# Altium project US29080671(A).PrjPCB (part 3 of 10)

## Sheet A7_FUNCTION2 - Ⅱ.SchDoc
size A3
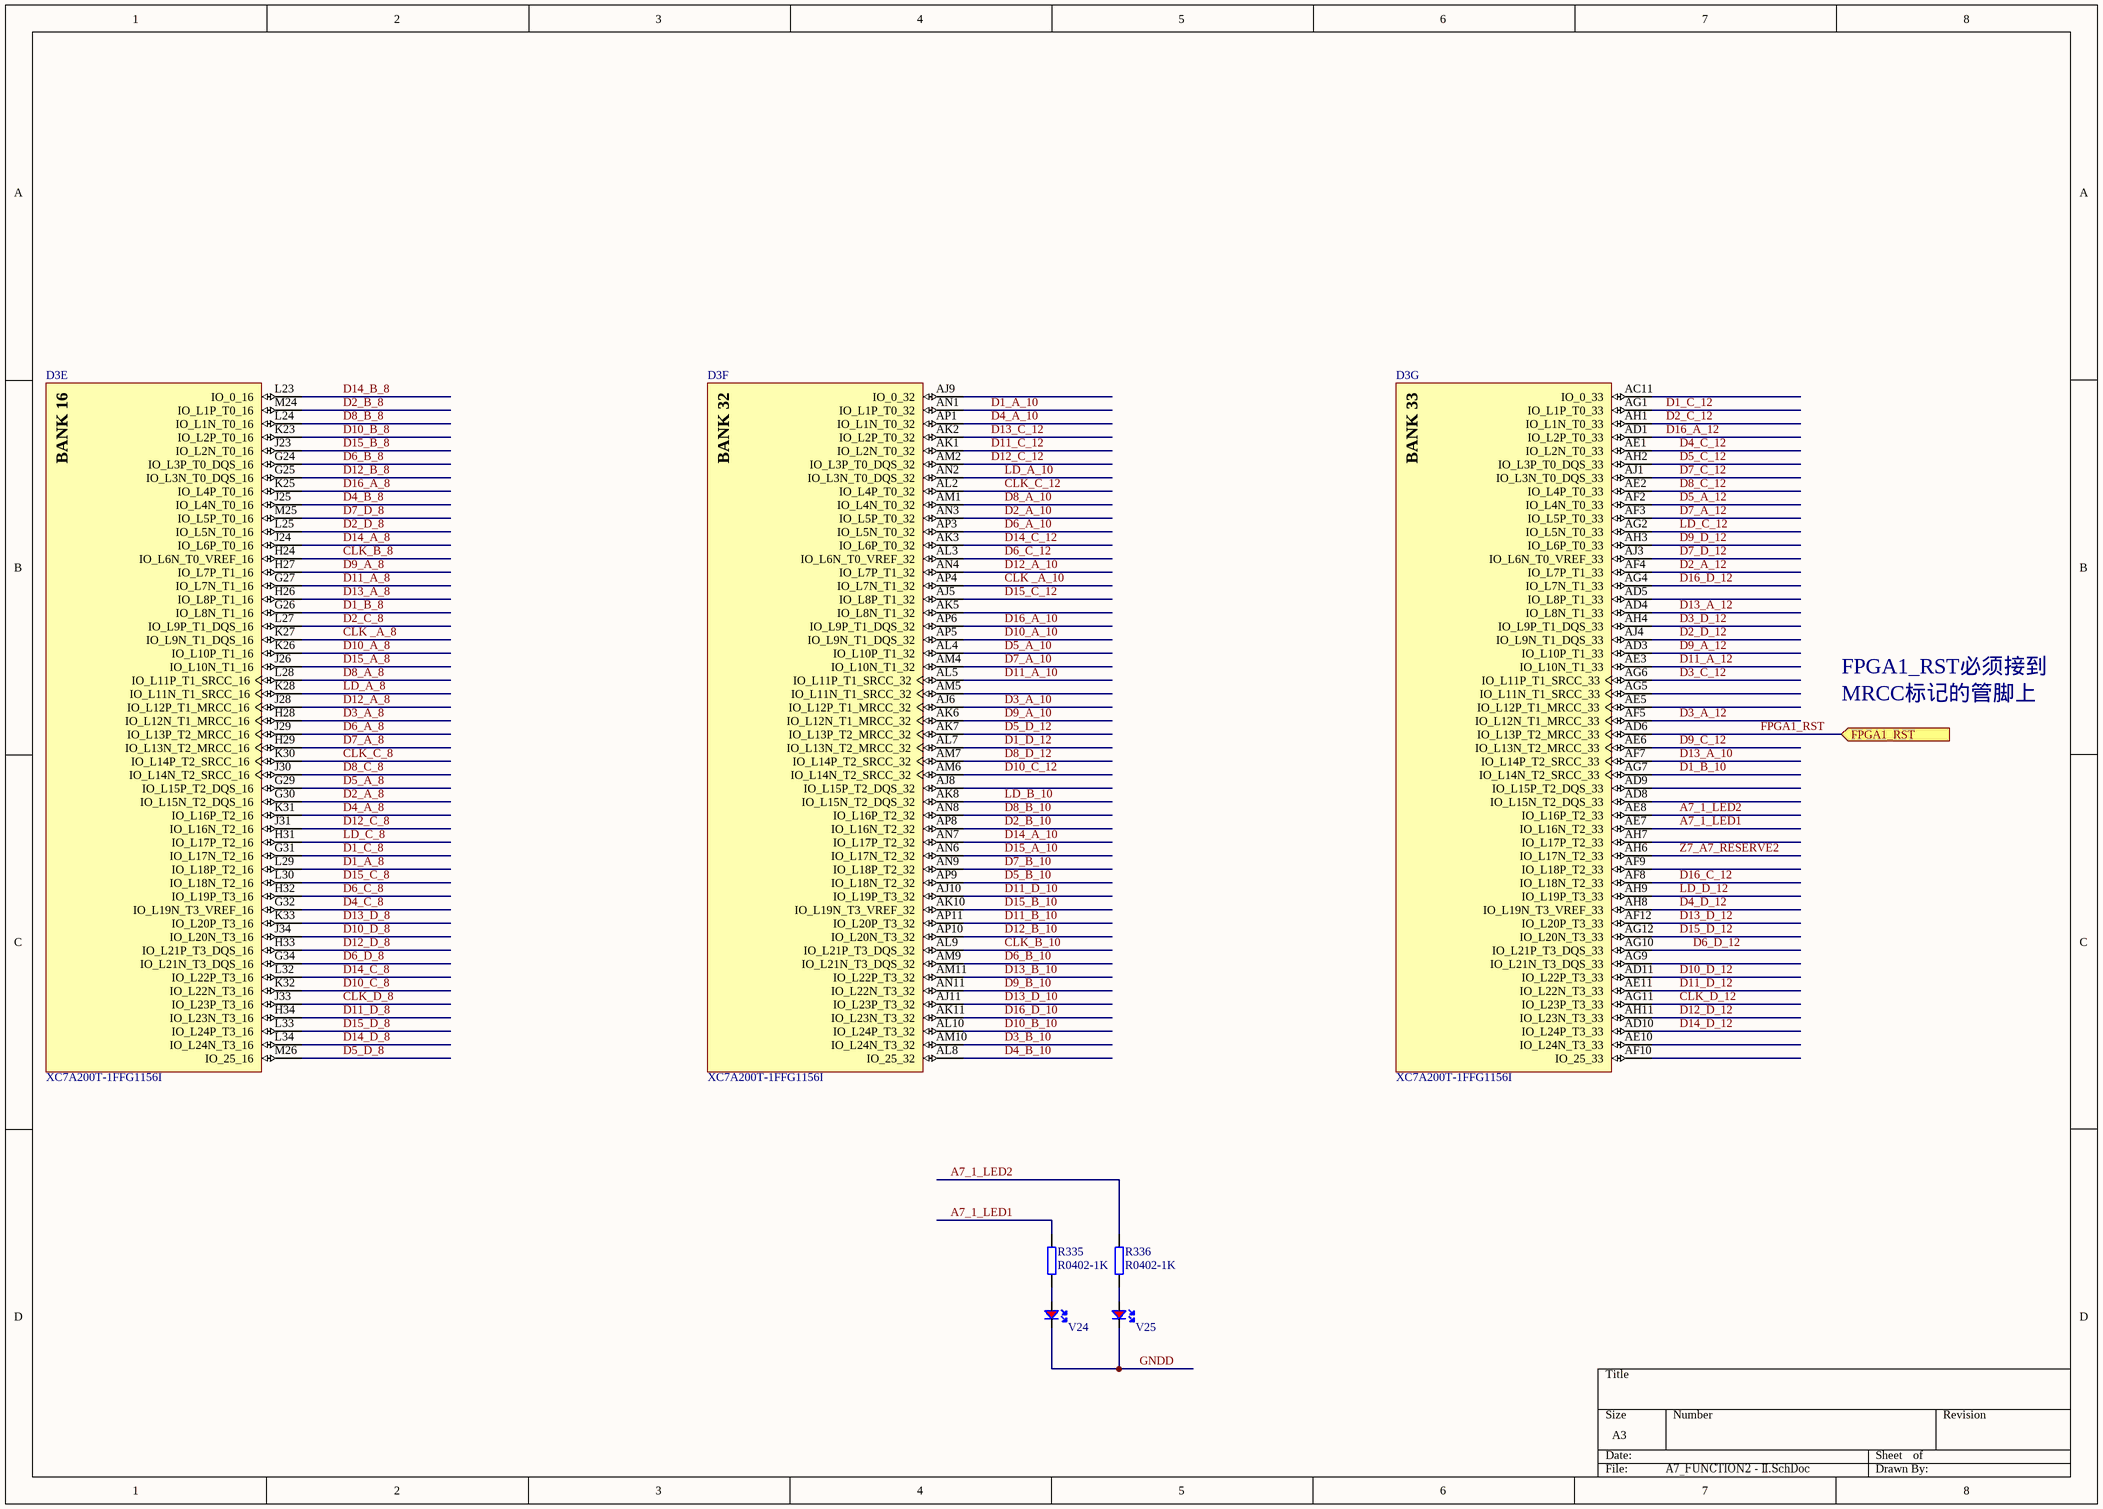
[diagram p11: A7_FUNCTION2 - Ⅱ.SchDoc]

### Parts
D3  XC7A200T-1FFG1156I  [FFG1156]  (parts E,F,G of 18)
R335  R0402-1K  [R0402]
R336  R0402-1K  [R0402]
V24  LED-R0603  [LED-R0603]  (value not drawn)
V25  LED-R0603  [LED-R0603]  (value not drawn)

### Ports
FPGA1_RST (in)

### Nets
GNDD: V24.2(K) V25.2(K)
A7_1_LED1: D3.AE7(IO_L16N_T2_33) R335.2
A7_1_LED2: D3.AE8(IO_L16P_T2_33) R336.2
CLK _A_8: D3.K27(IO_L9N_T1_DQS_16)
CLK _A_10: D3.AP4(IO_L7N_T1_32)
CLK_B_8: D3.H24(IO_L6N_T0_VREF_16)
CLK_B_10: D3.AL9(IO_L21P_T3_DQS_32)
CLK_C_8: D3.K30(IO_L14P_T2_SRCC_16)
CLK_C_12: D3.AL2(IO_L4P_T0_32)
CLK_D_8: D3.J33(IO_L23P_T3_16)
CLK_D_12: D3.AG11(IO_L23P_T3_33)
D1_A_8: D3.L29(IO_L18P_T2_16)
D1_A_10: D3.AN1(IO_L1P_T0_32)
D1_B_8: D3.G26(IO_L8N_T1_16)
D1_B_10: D3.AG7(IO_L14N_T2_SRCC_33)
D1_C_8: D3.G31(IO_L17N_T2_16)
D1_C_12: D3.AG1(IO_L1P_T0_33)
D1_D_12: D3.AL7(IO_L13N_T2_MRCC_32)
D2_A_8: D3.G30(IO_L15N_T2_DQS_16)
D2_A_10: D3.AN3(IO_L5P_T0_32)
D2_A_12: D3.AF4(IO_L7P_T1_33)
D2_B_8: D3.M24(IO_L1P_T0_16)
D2_B_10: D3.AP8(IO_L16N_T2_32)
D2_C_8: D3.L27(IO_L9P_T1_DQS_16)
D2_C_12: D3.AH1(IO_L1N_T0_33)
D2_D_8: D3.L25(IO_L5N_T0_16)
D2_D_12: D3.AJ4(IO_L9N_T1_DQS_33)
D3_A_8: D3.H28(IO_L12N_T1_MRCC_16)
D3_A_10: D3.AJ6(IO_L12P_T1_MRCC_32)
D3_A_12: D3.AF5(IO_L12N_T1_MRCC_33)
D3_B_10: D3.AM10(IO_L24N_T3_32)
D3_C_12: D3.AG6(IO_L11P_T1_SRCC_33)
D3_D_12: D3.AH4(IO_L9P_T1_DQS_33)
D4_A_8: D3.K31(IO_L16P_T2_16)
D4_A_10: D3.AP1(IO_L1N_T0_32)
D4_B_8: D3.J25(IO_L4N_T0_16)
D4_B_10: D3.AL8(IO_25_32)
D4_C_8: D3.G32(IO_L19N_T3_VREF_16)
D4_C_12: D3.AE1(IO_L2N_T0_33)
D4_D_12: D3.AH8(IO_L19N_T3_VREF_33)
D5_A_8: D3.G29(IO_L15P_T2_DQS_16)
D5_A_10: D3.AL4(IO_L10P_T1_32)
D5_A_12: D3.AF2(IO_L4N_T0_33)
D5_B_10: D3.AP9(IO_L18N_T2_32)
D5_C_12: D3.AH2(IO_L3P_T0_DQS_33)
D5_D_8: D3.M26(IO_25_16)
D5_D_12: D3.AK7(IO_L13P_T2_MRCC_32)
D6_A_8: D3.J29(IO_L13P_T2_MRCC_16)
D6_A_10: D3.AP3(IO_L5N_T0_32)
D6_B_8: D3.G24(IO_L3P_T0_DQS_16)
D6_B_10: D3.AM9(IO_L21N_T3_DQS_32)
D6_C_8: D3.H32(IO_L19P_T3_16)
D6_C_12: D3.AL3(IO_L6N_T0_VREF_32)
D6_D_8: D3.G34(IO_L21N_T3_DQS_16)
D6_D_12: D3.AG10(IO_L21P_T3_DQS_33)
D7_A_8: D3.H29(IO_L13N_T2_MRCC_16)
D7_A_10: D3.AM4(IO_L10N_T1_32)
D7_A_12: D3.AF3(IO_L5P_T0_33)
D7_B_10: D3.AN9(IO_L18P_T2_32)
D7_C_12: D3.AJ1(IO_L3N_T0_DQS_33)
D7_D_8: D3.M25(IO_L5P_T0_16)
D7_D_12: D3.AJ3(IO_L6N_T0_VREF_33)
D8_A_8: D3.L28(IO_L11P_T1_SRCC_16)
D8_A_10: D3.AM1(IO_L4N_T0_32)
D8_B_8: D3.L24(IO_L1N_T0_16)
D8_B_10: D3.AN8(IO_L16P_T2_32)
D8_C_8: D3.J30(IO_L14N_T2_SRCC_16)
D8_C_12: D3.AE2(IO_L4P_T0_33)
D8_D_12: D3.AM7(IO_L14P_T2_SRCC_32)
D9_A_8: D3.H27(IO_L7P_T1_16)
D9_A_10: D3.AK6(IO_L12N_T1_MRCC_32)
D9_A_12: D3.AD3(IO_L10P_T1_33)
D9_B_10: D3.AN11(IO_L22N_T3_32)
D9_C_12: D3.AE6(IO_L13N_T2_MRCC_33)
D9_D_12: D3.AH3(IO_L6P_T0_33)
D10_A_8: D3.K26(IO_L10P_T1_16)
D10_A_10: D3.AP5(IO_L9N_T1_DQS_32)
D10_B_8: D3.K23(IO_L2P_T0_16)
D10_B_10: D3.AL10(IO_L24P_T3_32)
D10_C_8: D3.K32(IO_L22N_T3_16)
D10_C_12: D3.AM6(IO_L14N_T2_SRCC_32)
D10_D_8: D3.J34(IO_L20N_T3_16)
D10_D_12: D3.AD11(IO_L22P_T3_33)
D11_A_8: D3.G27(IO_L7N_T1_16)
D11_A_10: D3.AL5(IO_L11P_T1_SRCC_32)
D11_A_12: D3.AE3(IO_L10N_T1_33)
D11_B_10: D3.AP11(IO_L20P_T3_32)
D11_C_12: D3.AK1(IO_L2N_T0_32)
D11_D_8: D3.H34(IO_L23N_T3_16)
D11_D_10: D3.AJ10(IO_L19P_T3_32)
D11_D_12: D3.AE11(IO_L22N_T3_33)
D12_A_8: D3.J28(IO_L12P_T1_MRCC_16)
D12_A_10: D3.AN4(IO_L7P_T1_32)
D12_B_8: D3.G25(IO_L3N_T0_DQS_16)
D12_B_10: D3.AP10(IO_L20N_T3_32)
D12_C_8: D3.J31(IO_L16N_T2_16)
D12_C_12: D3.AM2(IO_L3P_T0_DQS_32)
D12_D_8: D3.H33(IO_L21P_T3_DQS_16)
D12_D_12: D3.AH11(IO_L23N_T3_33)
D13_A_8: D3.H26(IO_L8P_T1_16)
D13_A_10: D3.AF7(IO_L14P_T2_SRCC_33)
D13_A_12: D3.AD4(IO_L8N_T1_33)
D13_B_10: D3.AM11(IO_L22P_T3_32)
D13_C_12: D3.AK2(IO_L2P_T0_32)
D13_D_8: D3.K33(IO_L20P_T3_16)
D13_D_10: D3.AJ11(IO_L23P_T3_32)
D13_D_12: D3.AF12(IO_L20P_T3_33)
D14_A_8: D3.J24(IO_L6P_T0_16)
D14_A_10: D3.AN7(IO_L17P_T2_32)
D14_B_8: D3.L23(IO_0_16)
D14_C_8: D3.L32(IO_L22P_T3_16)
D14_C_12: D3.AK3(IO_L6P_T0_32)
D14_D_8: D3.L34(IO_L24N_T3_16)
D14_D_12: D3.AD10(IO_L24P_T3_33)
D15_A_8: D3.J26(IO_L10N_T1_16)
D15_A_10: D3.AN6(IO_L17N_T2_32)
D15_B_8: D3.J23(IO_L2N_T0_16)
D15_B_10: D3.AK10(IO_L19N_T3_VREF_32)
D15_C_8: D3.L30(IO_L18N_T2_16)
D15_C_12: D3.AJ5(IO_L8P_T1_32)
D15_D_8: D3.L33(IO_L24P_T3_16)
D15_D_12: D3.AG12(IO_L20N_T3_33)
D16_A_8: D3.K25(IO_L4P_T0_16)
D16_A_10: D3.AP6(IO_L9P_T1_DQS_32)
D16_A_12: D3.AD1(IO_L2P_T0_33)
D16_C_12: D3.AF8(IO_L18N_T2_33)
D16_D_10: D3.AK11(IO_L23N_T3_32)
D16_D_12: D3.AG4(IO_L7N_T1_33)
FPGA1_RST: D3.AD6(IO_L13P_T2_MRCC_33) ; port FPGA1_RST
LD_A_8: D3.K28(IO_L11N_T1_SRCC_16)
LD_A_10: D3.AN2(IO_L3N_T0_DQS_32)
LD_B_10: D3.AK8(IO_L15N_T2_DQS_32)
LD_C_8: D3.H31(IO_L17P_T2_16)
LD_C_12: D3.AG2(IO_L5N_T0_33)
LD_D_12: D3.AH9(IO_L19P_T3_33)
Z7_A7_RESERVE2: D3.AH6(IO_L17N_T2_33)
NetR335_1: R335.1 V24.1(A)
NetR336_1: R336.1 V25.1(A)

Not connected (* = marked no-connect by the designer): D3 AC11(IO_0_33) AD5(IO_L8P_T1_33) AD8(IO_L15N_T2_DQS_33) AD9(IO_L15P_T2_DQS_33) AE5(IO_L12P_T1_MRCC_33) AE10(IO_L24N_T3_33) AF9(IO_L18P_T2_33) AF10(IO_25_33) AG5(IO_L11N_T1_SRCC_33) AG9(IO_L21N_T3_DQS_33) AH7(IO_L17P_T2_33) AJ8(IO_L15P_T2_DQS_32) AJ9(IO_0_32) AK5(IO_L8N_T1_32) AM5(IO_L11N_T1_SRCC_32)

### Notes on the sheet
- FPGA1_RST必须接到
- MRCC标记的管脚上
- (in symbol XC7A200T-1FFG1156I, part E) BANK 16
- (in symbol XC7A200T-1FFG1156I, part F) BANK 32
- (in symbol XC7A200T-1FFG1156I, part G) BANK 33

### Library data of the parts
D3 = XC7A200T-1FFG1156I: Artix-7 FPGA, 500 User I/Os, 16 GTP, 1156-Ball BGA, Speed Grade 1, Industrial Grade, Pb-Free; Manufacturer: Xilinx; Block RAM Blocks (18Kb): 730; Block RAM Blocks (36Kb): 365; Block RAM Blocks (Max Kb): 13140; CLBs (Slices): 33650; Clock Mgmt Tiles (CMTs): 10; DSP48E1 Slices: 740; Logic Cells: 215360; Max User I/O: 500; Speed Grade: -1; DatasheetVersion: v1.12; PackageVersion: Rev 1.8; PackageReference: FFG1156; PackageDescription: Flip-Chip BGA, Body 35 x 35 mm, 1.0 mm Pitch; CLBs (Max Distributed RAM Kb): 2888; Generic Part Number: XC7A200T; RoHS: Pb-Free; Mounting Technology: Surface Mount; Code_JEDEC: MS-034-AAR-1; PartNumber: XC7A200T-1FFG1156I; ComponentLink1Description: Datasheet; ComponentLink1URL: http://www.xilinx.com/support/documentation/data_sheets/ds180_7Series_Overview.pdf; ComponentLink2Description: Package Specification; ComponentLink2URL: http://www.xilinx.com/support/documentation/user_guides/ug475_7Series_Pkg_Pinout.pdf; ComponentLink3Description: DC and Switching Characteristics; ComponentLink3URL: http://www.xilinx.com/support/documentation/data_sheets/ds181_Artix_7_Data_Sheet.pdf; ComponentLink4Description: Package File; ComponentLink4URL: http://www.xilinx.com/support/packagefiles/a7packages/xc7a200tfbg676pkg.txt; ComponentLink5Description: Packaging and Pinout; ComponentLink5URL: http://www.xilinx.com/support/documentation/user_guides/ug475_7Series_Pkg_Pinout.pdf
R335 R336 = R0402-10K: Manufacturer: SAMSUNG; Part_number: R0402-1K; Part_type: RES; Value: R0402-1K; Schematic_Part: RES; PCB_Footprint: R0402
V24 V25 = LED-R0603: 表贴发光二极管, 0603封装, 体积1.6x0.8mm, 红色, 高度0.8mm; Part_type: DIODES; Part_number: LED-R0603; Value: LED-R0603; Schematic_Part: LED-R; PCB_Footprint: LED-R0603

## Sheet A7_FUNCTION3 - Ⅱ.SchDoc
size A3
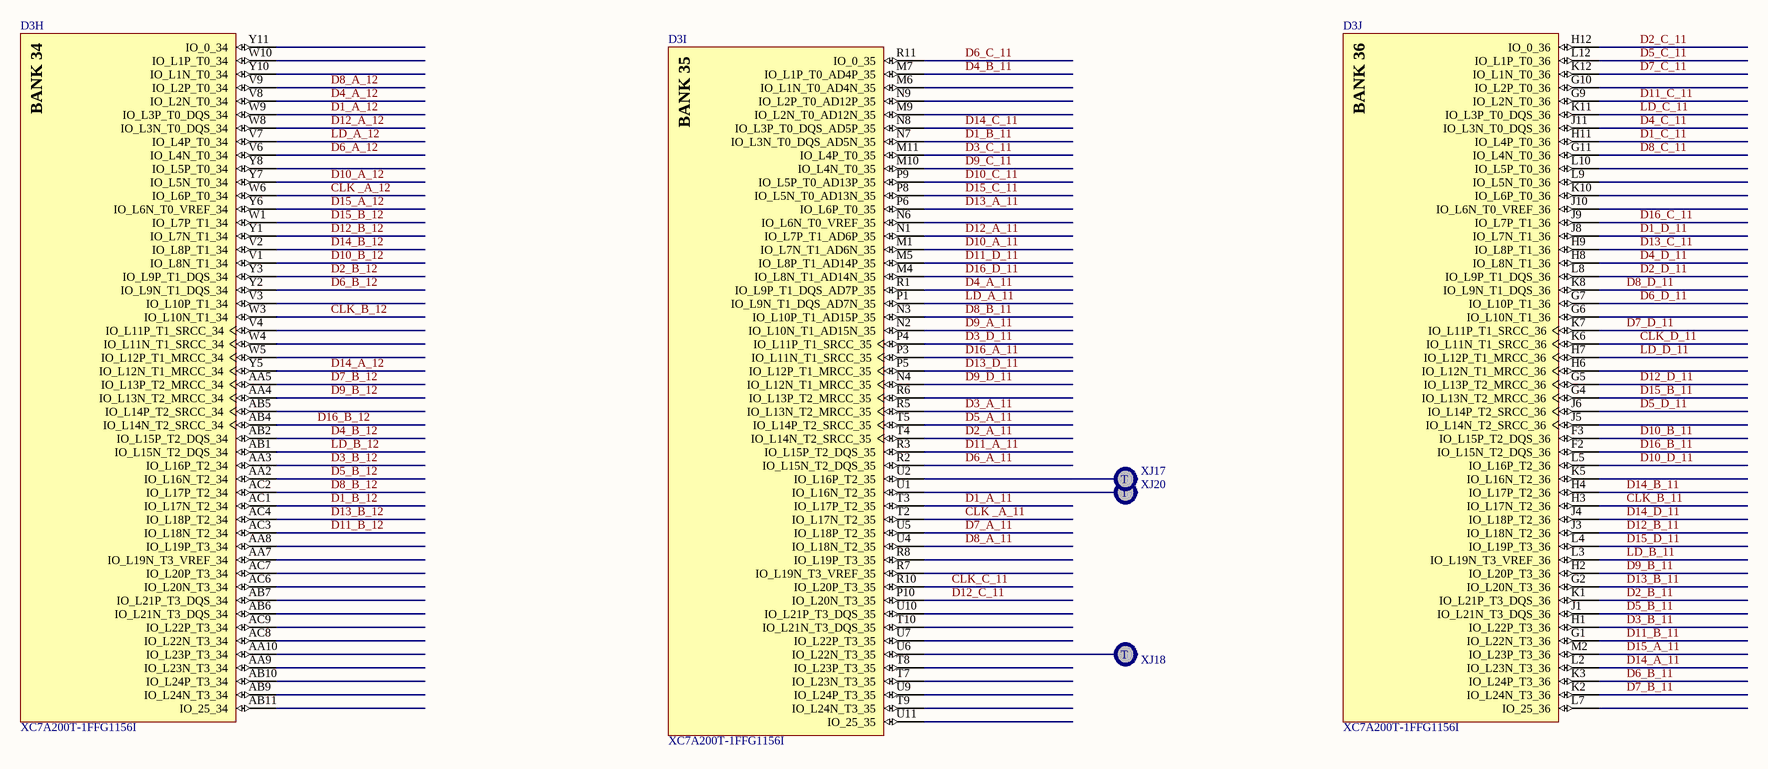
[diagram p12: A7_FUNCTION3 - Ⅱ.SchDoc]

### Parts
D3  XC7A200T-1FFG1156I  [FFG1156]  (parts H,I,J of 18)
XJ17  TESTPOINT  [TEST-pin]  (value not drawn)
XJ18  TESTPOINT  [TEST-pin]  (value not drawn)
XJ20  TESTPOINT  [TEST-pin]  (value not drawn)

### Nets
CLK _A_11: D3.T2(IO_L17N_T2_35)
CLK _A_12: D3.W6(IO_L6P_T0_34)
CLK_B_11: D3.H3(IO_L17N_T2_36)
CLK_B_12: D3.W3(IO_L10N_T1_34)
CLK_C_11: D3.R10(IO_L20P_T3_35)
CLK_D_11: D3.K6(IO_L11N_T1_SRCC_36)
D1_A_11: D3.T3(IO_L17P_T2_35)
D1_A_12: D3.W9(IO_L3P_T0_DQS_34)
D1_B_11: D3.N7(IO_L3N_T0_DQS_AD5N_35)
D1_B_12: D3.AC1(IO_L17N_T2_34)
D1_C_11: D3.H11(IO_L4P_T0_36)
D1_D_11: D3.J8(IO_L7N_T1_36)
D2_A_11: D3.T4(IO_L14N_T2_SRCC_35)
D2_B_11: D3.K1(IO_L21P_T3_DQS_36)
D2_B_12: D3.Y3(IO_L9P_T1_DQS_34)
D2_C_11: D3.H12(IO_0_36)
D2_D_11: D3.L8(IO_L9P_T1_DQS_36)
D3_A_11: D3.R5(IO_L13N_T2_MRCC_35)
D3_B_11: D3.H1(IO_L22P_T3_36)
D3_B_12: D3.AA3(IO_L16P_T2_34)
D3_C_11: D3.M11(IO_L4P_T0_35)
D3_D_11: D3.P4(IO_L11P_T1_SRCC_35)
D4_A_11: D3.R1(IO_L9P_T1_DQS_AD7P_35)
D4_A_12: D3.V8(IO_L2N_T0_34)
D4_B_11: D3.M7(IO_L1P_T0_AD4P_35)
D4_B_12: D3.AB2(IO_L15P_T2_DQS_34)
D4_C_11: D3.J11(IO_L3N_T0_DQS_36)
D4_D_11: D3.H8(IO_L8N_T1_36)
D5_A_11: D3.T5(IO_L14P_T2_SRCC_35)
D5_B_11: D3.J1(IO_L21N_T3_DQS_36)
D5_B_12: D3.AA2(IO_L16N_T2_34)
D5_C_11: D3.L12(IO_L1P_T0_36)
D5_D_11: D3.J6(IO_L14P_T2_SRCC_36)
D6_A_11: D3.R2(IO_L15N_T2_DQS_35)
D6_A_12: D3.V6(IO_L4N_T0_34)
D6_B_11: D3.K3(IO_L24P_T3_36)
D6_B_12: D3.Y2(IO_L9N_T1_DQS_34)
D6_C_11: D3.R11(IO_0_35)
D6_D_11: D3.G7(IO_L10P_T1_36)
D7_A_11: D3.U5(IO_L18P_T2_35)
D7_B_11: D3.K2(IO_L24N_T3_36)
D7_B_12: D3.AA5(IO_L13P_T2_MRCC_34)
D7_C_11: D3.K12(IO_L1N_T0_36)
D7_D_11: D3.K7(IO_L11P_T1_SRCC_36)
D8_A_11: D3.U4(IO_L18N_T2_35)
D8_A_12: D3.V9(IO_L2P_T0_34)
D8_B_11: D3.N3(IO_L10P_T1_AD15P_35)
D8_B_12: D3.AC2(IO_L17P_T2_34)
D8_C_11: D3.G11(IO_L4N_T0_36)
D8_D_11: D3.K8(IO_L9N_T1_DQS_36)
D9_A_11: D3.N2(IO_L10N_T1_AD15N_35)
D9_B_11: D3.H2(IO_L20P_T3_36)
D9_B_12: D3.AA4(IO_L13N_T2_MRCC_34)
D9_C_11: D3.M10(IO_L4N_T0_35)
D9_D_11: D3.N4(IO_L12N_T1_MRCC_35)
D10_A_11: D3.M1(IO_L7N_T1_AD6N_35)
D10_A_12: D3.Y7(IO_L5N_T0_34)
D10_B_11: D3.F3(IO_L15P_T2_DQS_36)
D10_B_12: D3.V1(IO_L8N_T1_34)
D10_C_11: D3.P9(IO_L5P_T0_AD13P_35)
D10_D_11: D3.L5(IO_L16P_T2_36)
D11_A_11: D3.R3(IO_L15P_T2_DQS_35)
D11_B_11: D3.G1(IO_L22N_T3_36)
D11_B_12: D3.AC3(IO_L18N_T2_34)
D11_C_11: D3.G9(IO_L2N_T0_36)
D11_D_11: D3.M5(IO_L8P_T1_AD14P_35)
D12_A_11: D3.N1(IO_L7P_T1_AD6P_35)
D12_A_12: D3.W8(IO_L3N_T0_DQS_34)
D12_B_11: D3.J3(IO_L18N_T2_36)
D12_B_12: D3.Y1(IO_L7N_T1_34)
D12_C_11: D3.P10(IO_L20N_T3_35)
D12_D_11: D3.G5(IO_L13P_T2_MRCC_36)
D13_A_11: D3.P6(IO_L6P_T0_35)
D13_B_11: D3.G2(IO_L20N_T3_36)
D13_B_12: D3.AC4(IO_L18P_T2_34)
D13_C_11: D3.H9(IO_L8P_T1_36)
D13_D_11: D3.P5(IO_L12P_T1_MRCC_35)
D14_A_11: D3.L2(IO_L23N_T3_36)
D14_A_12: D3.Y5(IO_L12N_T1_MRCC_34)
D14_B_11: D3.H4(IO_L17P_T2_36)
D14_B_12: D3.V2(IO_L8P_T1_34)
D14_C_11: D3.N8(IO_L3P_T0_DQS_AD5P_35)
D14_D_11: D3.J4(IO_L18P_T2_36)
D15_A_11: D3.M2(IO_L23P_T3_36)
D15_A_12: D3.Y6(IO_L6N_T0_VREF_34)
D15_B_11: D3.G4(IO_L13N_T2_MRCC_36)
D15_B_12: D3.W1(IO_L7P_T1_34)
D15_C_11: D3.P8(IO_L5N_T0_AD13N_35)
D15_D_11: D3.L4(IO_L19P_T3_36)
D16_A_11: D3.P3(IO_L11N_T1_SRCC_35)
D16_B_11: D3.F2(IO_L15N_T2_DQS_36)
D16_B_12: D3.AB4(IO_L14N_T2_SRCC_34)
D16_C_11: D3.J9(IO_L7P_T1_36)
D16_D_11: D3.M4(IO_L8N_T1_AD14N_35)
LD_A_11: D3.P1(IO_L9N_T1_DQS_AD7N_35)
LD_A_12: D3.V7(IO_L4P_T0_34)
LD_B_11: D3.L3(IO_L19N_T3_VREF_36)
LD_B_12: D3.AB1(IO_L15N_T2_DQS_34)
LD_C_11: D3.K11(IO_L3P_T0_DQS_36)
LD_D_11: D3.H7(IO_L12P_T1_MRCC_36)
NetD3_U1: D3.U1(IO_L16N_T2_35) XJ20.1(T)
NetD3_U2: D3.U2(IO_L16P_T2_35) XJ17.1(T)
NetD3_U6: D3.U6(IO_L22N_T3_35) XJ18.1(T)

Not connected (* = marked no-connect by the designer): D3 AA7(IO_L19N_T3_VREF_34) AA8(IO_L19P_T3_34) AA9(IO_L23N_T3_34) AA10(IO_L23P_T3_34) AB5(IO_L14P_T2_SRCC_34) AB6(IO_L21N_T3_DQS_34) AB7(IO_L21P_T3_DQS_34) AB9(IO_L24N_T3_34) AB10(IO_L24P_T3_34) AB11(IO_25_34) AC6(IO_L20N_T3_34) AC7(IO_L20P_T3_34) AC8(IO_L22N_T3_34) AC9(IO_L22P_T3_34) G6(IO_L10N_T1_36) G10(IO_L2P_T0_36) H6(IO_L12N_T1_MRCC_36) J5(IO_L14N_T2_SRCC_36) J10(IO_L6N_T0_VREF_36) K5(IO_L16N_T2_36) K10(IO_L6P_T0_36) L7(IO_25_36) L9(IO_L5N_T0_36) L10(IO_L5P_T0_36) M6(IO_L1N_T0_AD4N_35) M9(IO_L2N_T0_AD12N_35) N6(IO_L6N_T0_VREF_35) N9(IO_L2P_T0_AD12P_35) R6(IO_L13P_T2_MRCC_35) R7(IO_L19N_T3_VREF_35) R8(IO_L19P_T3_35) T7(IO_L23N_T3_35) T8(IO_L23P_T3_35) T9(IO_L24N_T3_35) T10(IO_L21N_T3_DQS_35) U7(IO_L22P_T3_35) U9(IO_L24P_T3_35) U10(IO_L21P_T3_DQS_35) U11(IO_25_35) V3(IO_L10P_T1_34) V4(IO_L11P_T1_SRCC_34) W4(IO_L11N_T1_SRCC_34) W5(IO_L12P_T1_MRCC_34) W10(IO_L1P_T0_34) Y8(IO_L5P_T0_34) Y10(IO_L1N_T0_34) Y11(IO_0_34)

### Notes on the sheet
- (in symbol XC7A200T-1FFG1156I, part H) BANK 34
- (in symbol XC7A200T-1FFG1156I, part I) BANK 35
- (in symbol XC7A200T-1FFG1156I, part J) BANK 36

### Library data of the parts
D3 = XC7A200T-1FFG1156I: as D3 on sheet A7_FUNCTION2 - Ⅱ; DatasheetVersion: v1.12; PackageVersion: Rev 1.8; PackageReference: FFG1156; PackageDescription: Flip-Chip BGA, Body 35 x 35 mm, 1.0 mm Pitch; CLBs (Max Distributed RAM Kb): 2888; Generic Part Number: XC7A200T; RoHS: Pb-Free; Mounting Technology: Surface Mount; Code_JEDEC: MS-034-AAR-1; PartNumber: XC7A200T-1FFG1156I; ComponentLink1Description: Datasheet; ComponentLink1URL: http://www.xilinx.com/support/documentation/data_sheets/ds180_7Series_Overview.pdf; ComponentLink2Description: Package Specification; ComponentLink2URL: http://www.xilinx.com/support/documentation/user_guides/ug475_7Series_Pkg_Pinout.pdf; ComponentLink3Description: DC and Switching Characteristics; ComponentLink3URL: http://www.xilinx.com/support/documentation/data_sheets/ds181_Artix_7_Data_Sheet.pdf; ComponentLink4Description: Package File; ComponentLink4URL: http://www.xilinx.com/support/packagefiles/a7packages/xc7a200tfbg676pkg.txt; ComponentLink5Description: Packaging and Pinout; ComponentLink5URL: http://www.xilinx.com/support/documentation/user_guides/ug475_7Series_Pkg_Pinout.pdf
XJ17 XJ18 XJ20 = TESTPOINT: 测试点; Part_type: Miscellaneous; Part_number: TESTPOINT; Value: TESTPOINT; Schematic_Part: TESTPOINT; PCB_Footprint: TEST-pin

## Sheet A7_JTAG&CONFIG - Ⅱ.SchDoc
size A3
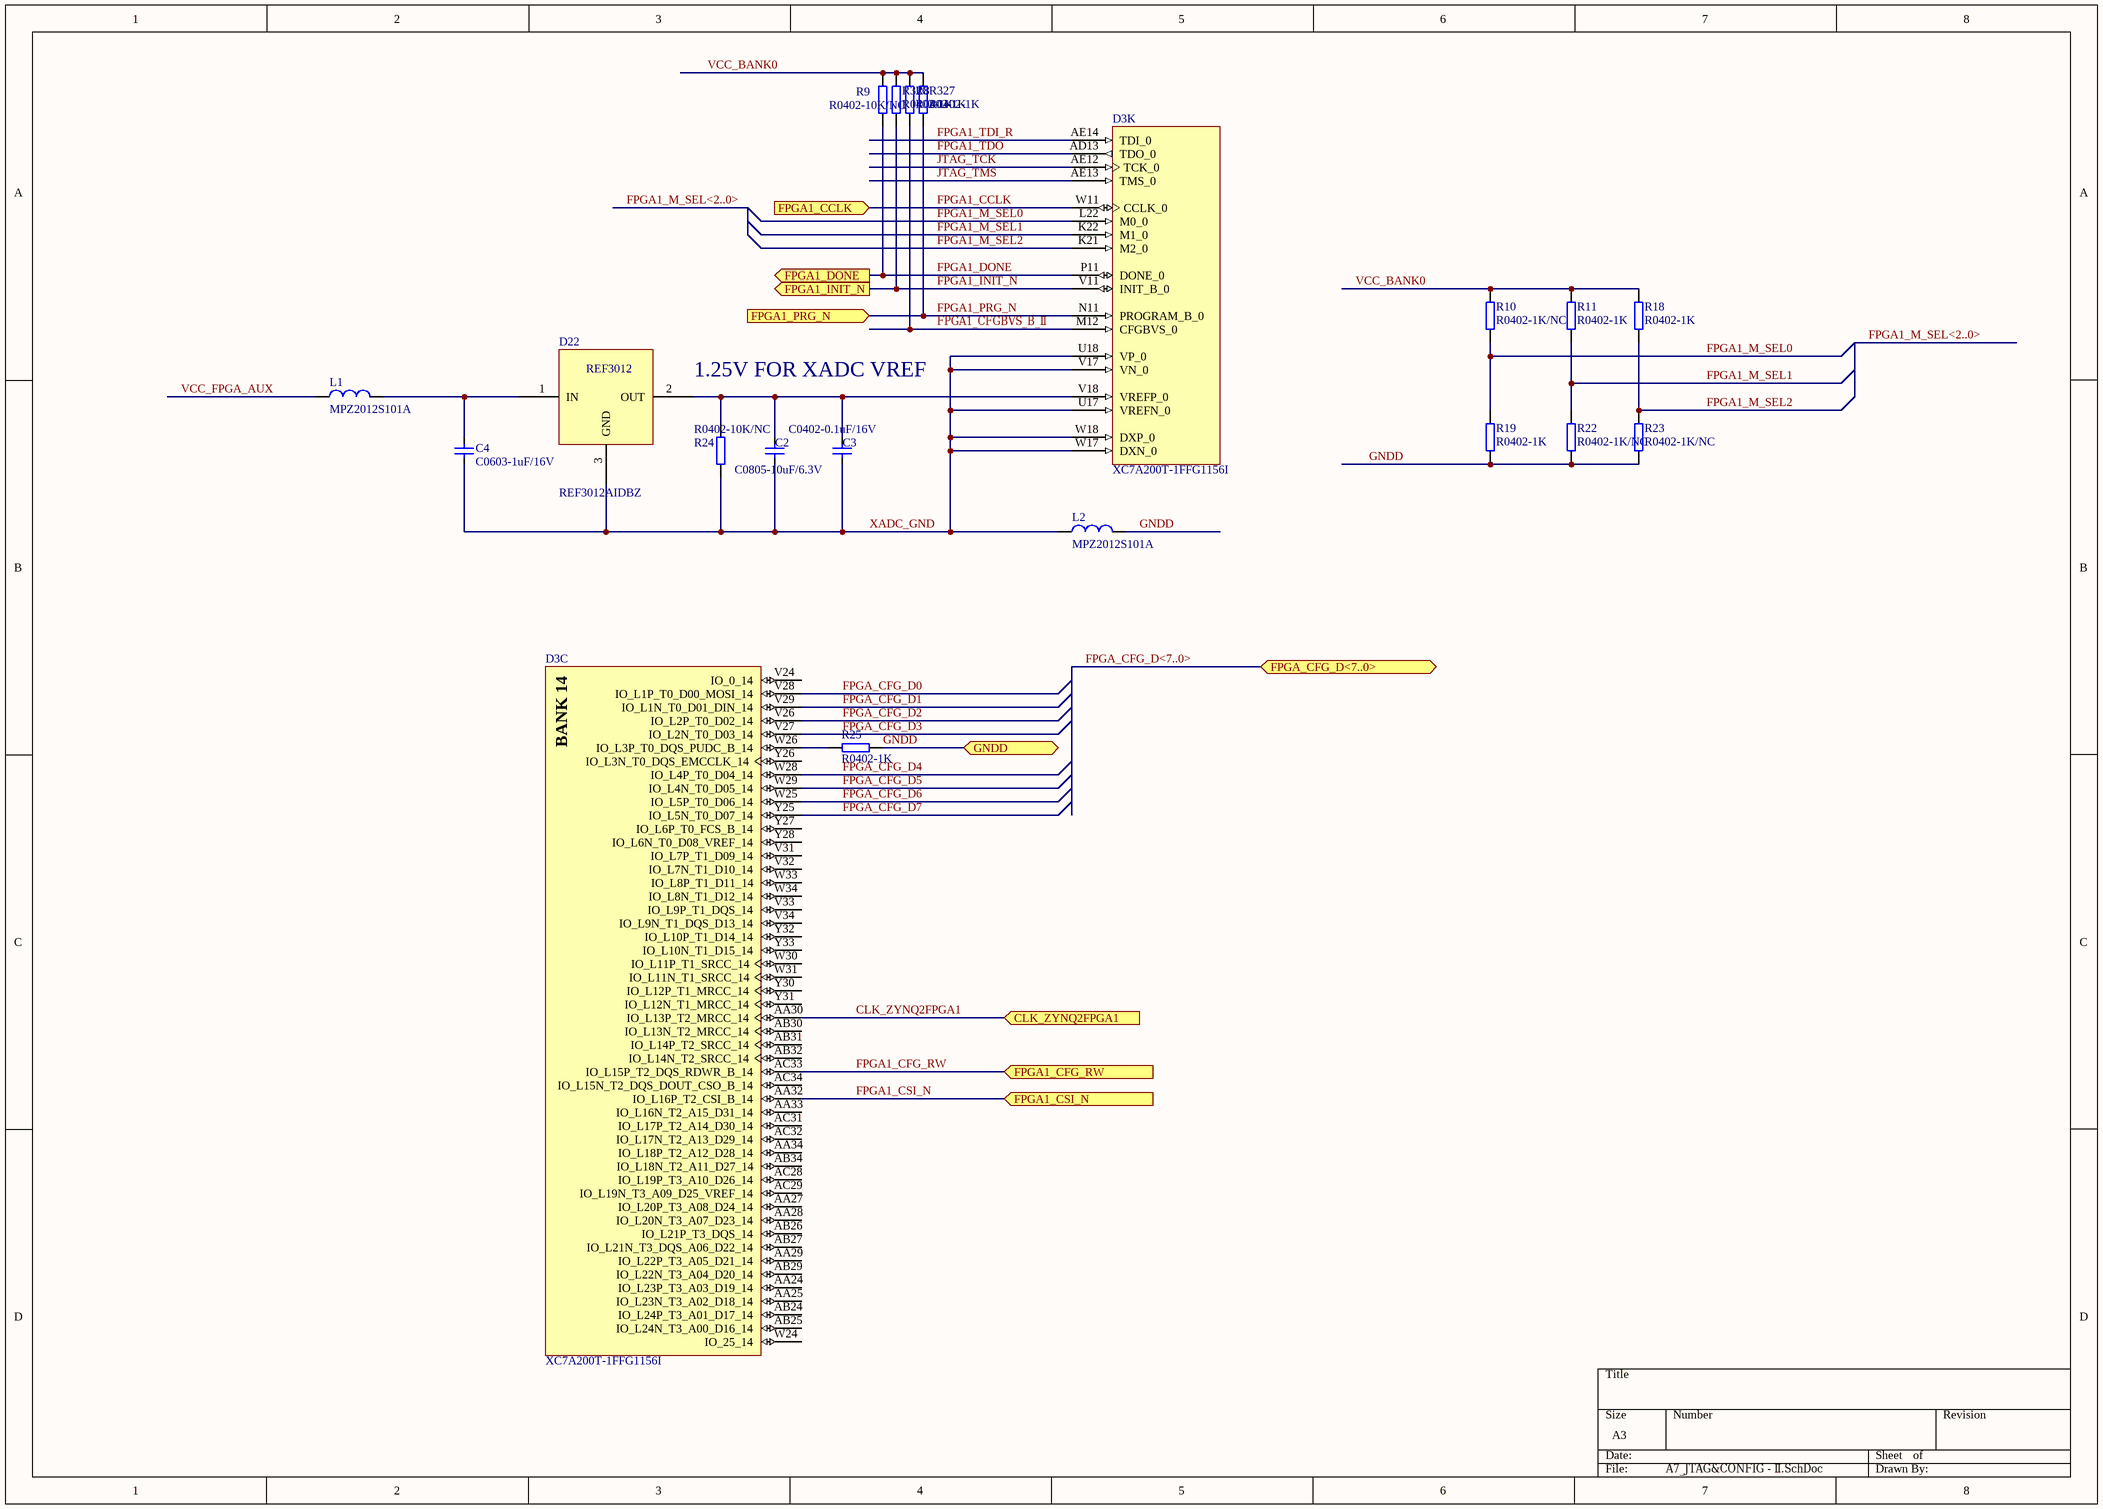
[diagram p13: A7_JTAG&CONFIG - Ⅱ.SchDoc]

### Parts
C2  C0805-10uF/6.3V  [C0805]
C3  C0402-0.1uF/16V  [C0402]
C4  C0603-1uF/16V  [C0603]
D3  XC7A200T-1FFG1156I  [FFG1156]  (parts C,K of 18)
D22  REF3012AIDBZ  [SOT-23]
L1  MPZ2012S101A  [R0805]
L2  MPZ2012S101A  [R0805]
R8  R0402-1K  [R0402]
R9  R0402-10K/NC  [R0402]
R10  R0402-1K/NC  [R0402]
R11  R0402-1K  [R0402]
R18  R0402-1K  [R0402]
R19  R0402-1K  [R0402]
R22  R0402-1K/NC  [R0402]
R23  R0402-1K/NC  [R0402]
R24  R0402-10K/NC  [R0402]
R25  R0402-1K  [R0402]
R326  R0402-1K  [R0402]
R327  R0402-1K  [R0402]

### Ports
CLK_ZYNQ2FPGA1 (in), FPGA1_CCLK (in), FPGA1_CFG_RW (in), FPGA1_CSI_N (in), FPGA1_DONE (out), FPGA1_INIT_N (out), FPGA1_PRG_N (in), FPGA_CFG_D<7..0>, GNDD

### Nets
GNDD: L2.2 R19.1 R22.1 R23.1 R25.1 ; port GNDD
VCC_BANK0: R8.2 R9.2 R10.2 R11.2 R18.2 R326.2 R327.2  [project net VCC3V3]
VCC_FPGA_AUX: L1.1  [project net VCC1V8]
CLK_ZYNQ2FPGA1: D3.AA30(IO_L13P_T2_MRCC_14) ; port CLK_ZYNQ2FPGA1
FPGA1_CCLK: D3.W11(CCLK_0) ; port FPGA1_CCLK
FPGA1_CFG_RW: D3.AC33(IO_L15P_T2_DQS_RDWR_B_14) ; port FPGA1_CFG_RW
FPGA1_CFGBVS_B_Ⅱ: D3.M12(CFGBVS_0) R8.1
FPGA1_CSI_N: D3.AA32(IO_L16P_T2_CSI_B_14) ; port FPGA1_CSI_N
FPGA1_DONE: D3.P11(DONE_0) R9.1 ; port FPGA1_DONE
FPGA1_INIT_N: D3.V11(INIT_B_0) R326.1 ; port FPGA1_INIT_N
FPGA1_M_SEL0: D3.L22(M0_0) R10.1 R19.2
FPGA1_M_SEL1: D3.K22(M1_0) R11.1 R22.2
FPGA1_M_SEL2: D3.K21(M2_0) R18.1 R23.2
FPGA1_PRG_N: D3.N11(PROGRAM_B_0) R327.1 ; port FPGA1_PRG_N
FPGA1_TDI_R: D3.AE14(TDI_0)
FPGA1_TDO: D3.AD13(TDO_0)
FPGA_CFG_D0: D3.V28(IO_L1P_T0_D00_MOSI_14)
FPGA_CFG_D1: D3.V29(IO_L1N_T0_D01_DIN_14)
FPGA_CFG_D2: D3.V26(IO_L2P_T0_D02_14)
FPGA_CFG_D3: D3.V27(IO_L2N_T0_D03_14)
FPGA_CFG_D4: D3.W28(IO_L4P_T0_D04_14)
FPGA_CFG_D5: D3.W29(IO_L4N_T0_D05_14)
FPGA_CFG_D6: D3.W25(IO_L5P_T0_D06_14)
FPGA_CFG_D7: D3.Y25(IO_L5N_T0_D07_14)
JTAG_TCK: D3.AE12(TCK_0)
JTAG_TMS: D3.AE13(TMS_0)
XADC_GND: C2.2 C3.2 C4.2 D3.U17(VREFN_0) D3.U18(VP_0) D3.V17(VN_0) D3.W17(DXN_0) D3.W18(DXP_0) D22.3(GND) L2.1 R24.2
NetC2_1: C2.1 C3.1 D3.V18(VREFP_0) D22.2(OUT) R24.1
NetC4_1: C4.1 D22.1(IN) L1.2
NetD3_W26: D3.W26(IO_L3P_T0_DQS_PUDC_B_14) R25.2

Not connected (* = marked no-connect by the designer): D3 AA24(IO_L23P_T3_A03_D19_14) AA25(IO_L23N_T3_A02_D18_14) AA27(IO_L20P_T3_A08_D24_14) AA28(IO_L20N_T3_A07_D23_14) AA29(IO_L22P_T3_A05_D21_14) AA33(IO_L16N_T2_A15_D31_14) AA34(IO_L18P_T2_A12_D28_14) AB24(IO_L24P_T3_A01_D17_14) AB25(IO_L24N_T3_A00_D16_14) AB26(IO_L21P_T3_DQS_14) AB27(IO_L21N_T3_DQS_A06_D22_14) AB29(IO_L22N_T3_A04_D20_14) AB30(IO_L13N_T2_MRCC_14) AB31(IO_L14P_T2_SRCC_14) AB32(IO_L14N_T2_SRCC_14) AB34(IO_L18N_T2_A11_D27_14) AC28(IO_L19P_T3_A10_D26_14) AC29(IO_L19N_T3_A09_D25_VREF_14) AC31(IO_L17P_T2_A14_D30_14) AC32(IO_L17N_T2_A13_D29_14) AC34(IO_L15N_T2_DQS_DOUT_CSO_B_14) V24(IO_0_14) V31(IO_L7P_T1_D09_14) V32(IO_L7N_T1_D10_14) V33(IO_L9P_T1_DQS_14) V34(IO_L9N_T1_DQS_D13_14) W24(IO_25_14) W30(IO_L11P_T1_SRCC_14) W31(IO_L11N_T1_SRCC_14) W33(IO_L8P_T1_D11_14) W34(IO_L8N_T1_D12_14) Y26(IO_L3N_T0_DQS_EMCCLK_14) Y27(IO_L6P_T0_FCS_B_14) Y28(IO_L6N_T0_D08_VREF_14) Y30(IO_L12P_T1_MRCC_14) Y31(IO_L12N_T1_MRCC_14) Y32(IO_L10P_T1_D14_14) Y33(IO_L10N_T1_D15_14)

### Buses and harness runs
bus FPGA1_M_SEL<2..0>
bus FPGA_CFG_D<7..0> = port FPGA_CFG_D<7..0>

### Notes on the sheet
- 1.25V FOR XADC VREF
- (in symbol XC7A200T-1FFG1156I, part C) BANK 14

### Library data of the parts
C2 = C1210-22uF/16V: Part_number: C0805-10uF/6.3V; Part_type: CAP; Value: C0805-10uF/6.3V; Schematic_Part: CAP; PCB_Footprint: C0805
C3 = C0402-0.1uF/16V: X7R; Manufacturer: SAMSUNG; Manufacturer_p/n: CL05X7R104KO5NNN; Part_number: C0402-0.1uF/16V; Part_type: CAP; Value: C0402-0.1uF/16V; temperature: -55℃\+125℃; Schematic_Part: CAP; PCB_Footprint: C0402; datasheet: #DataSheet\C_Samsung_General Capacitors.pdf#
C4 = C0603-100nF/16V: X7R; Part_number: C0603-1uF/16V; Part_type: CAP; Value: C0603-1uF/16V; temperature: -55℃\+125℃; Schematic_Part: CAP; PCB_Footprint: C0603
D3 = XC7A200T-1FFG1156I: as D3 on sheet A7_FUNCTION2 - Ⅱ; DatasheetVersion: v1.12; PackageVersion: Rev 1.8; PackageReference: FFG1156; PackageDescription: Flip-Chip BGA, Body 35 x 35 mm, 1.0 mm Pitch; CLBs (Max Distributed RAM Kb): 2888; Generic Part Number: XC7A200T; RoHS: Pb-Free; Mounting Technology: Surface Mount; Code_JEDEC: MS-034-AAR-1; PartNumber: XC7A200T-1FFG1156I; ComponentLink1Description: Datasheet; ComponentLink1URL: http://www.xilinx.com/support/documentation/data_sheets/ds180_7Series_Overview.pdf; ComponentLink2Description: Package Specification; ComponentLink2URL: http://www.xilinx.com/support/documentation/user_guides/ug475_7Series_Pkg_Pinout.pdf; ComponentLink3Description: DC and Switching Characteristics; ComponentLink3URL: http://www.xilinx.com/support/documentation/data_sheets/ds181_Artix_7_Data_Sheet.pdf; ComponentLink4Description: Package File; ComponentLink4URL: http://www.xilinx.com/support/packagefiles/a7packages/xc7a200tfbg676pkg.txt; ComponentLink5Description: Packaging and Pinout; ComponentLink5URL: http://www.xilinx.com/support/documentation/user_guides/ug475_7Series_Pkg_Pinout.pdf
L1 L2 = FB0805-330R@100MHz: Manufacturer: TDK; Part_number: MPZ2012S101A; Part_type: BEAD; temperature: -55℃\+125℃; Value1: 330R@100MHz; Schematic_Part: BEAD; PCB_Footprint: R0805; Manufacturer_p/n: MPZ2012S101A
R8-R11 R18 R19 R22-R25 R326 R327 = R0402-10K: Manufacturer: SAMSUNG; Part_type: RES; Schematic_Part: RES; PCB_Footprint: R0402
  R8 R11 R18 R19 R25 R326 R327: Part_number: R0402-1K; Value: R0402-1K
  R9 R24: Part_number: R0402-10K/NC; Value: R0402-10K/NC
  R10 R22 R23: Part_number: R0402-1K/NC; Value: R0402-1K/NC
D22 = REF3012AIDBZ: Part_number: REF3012AIDBZ

## Sheet A7_MGT - Ⅱ.SchDoc
size A3
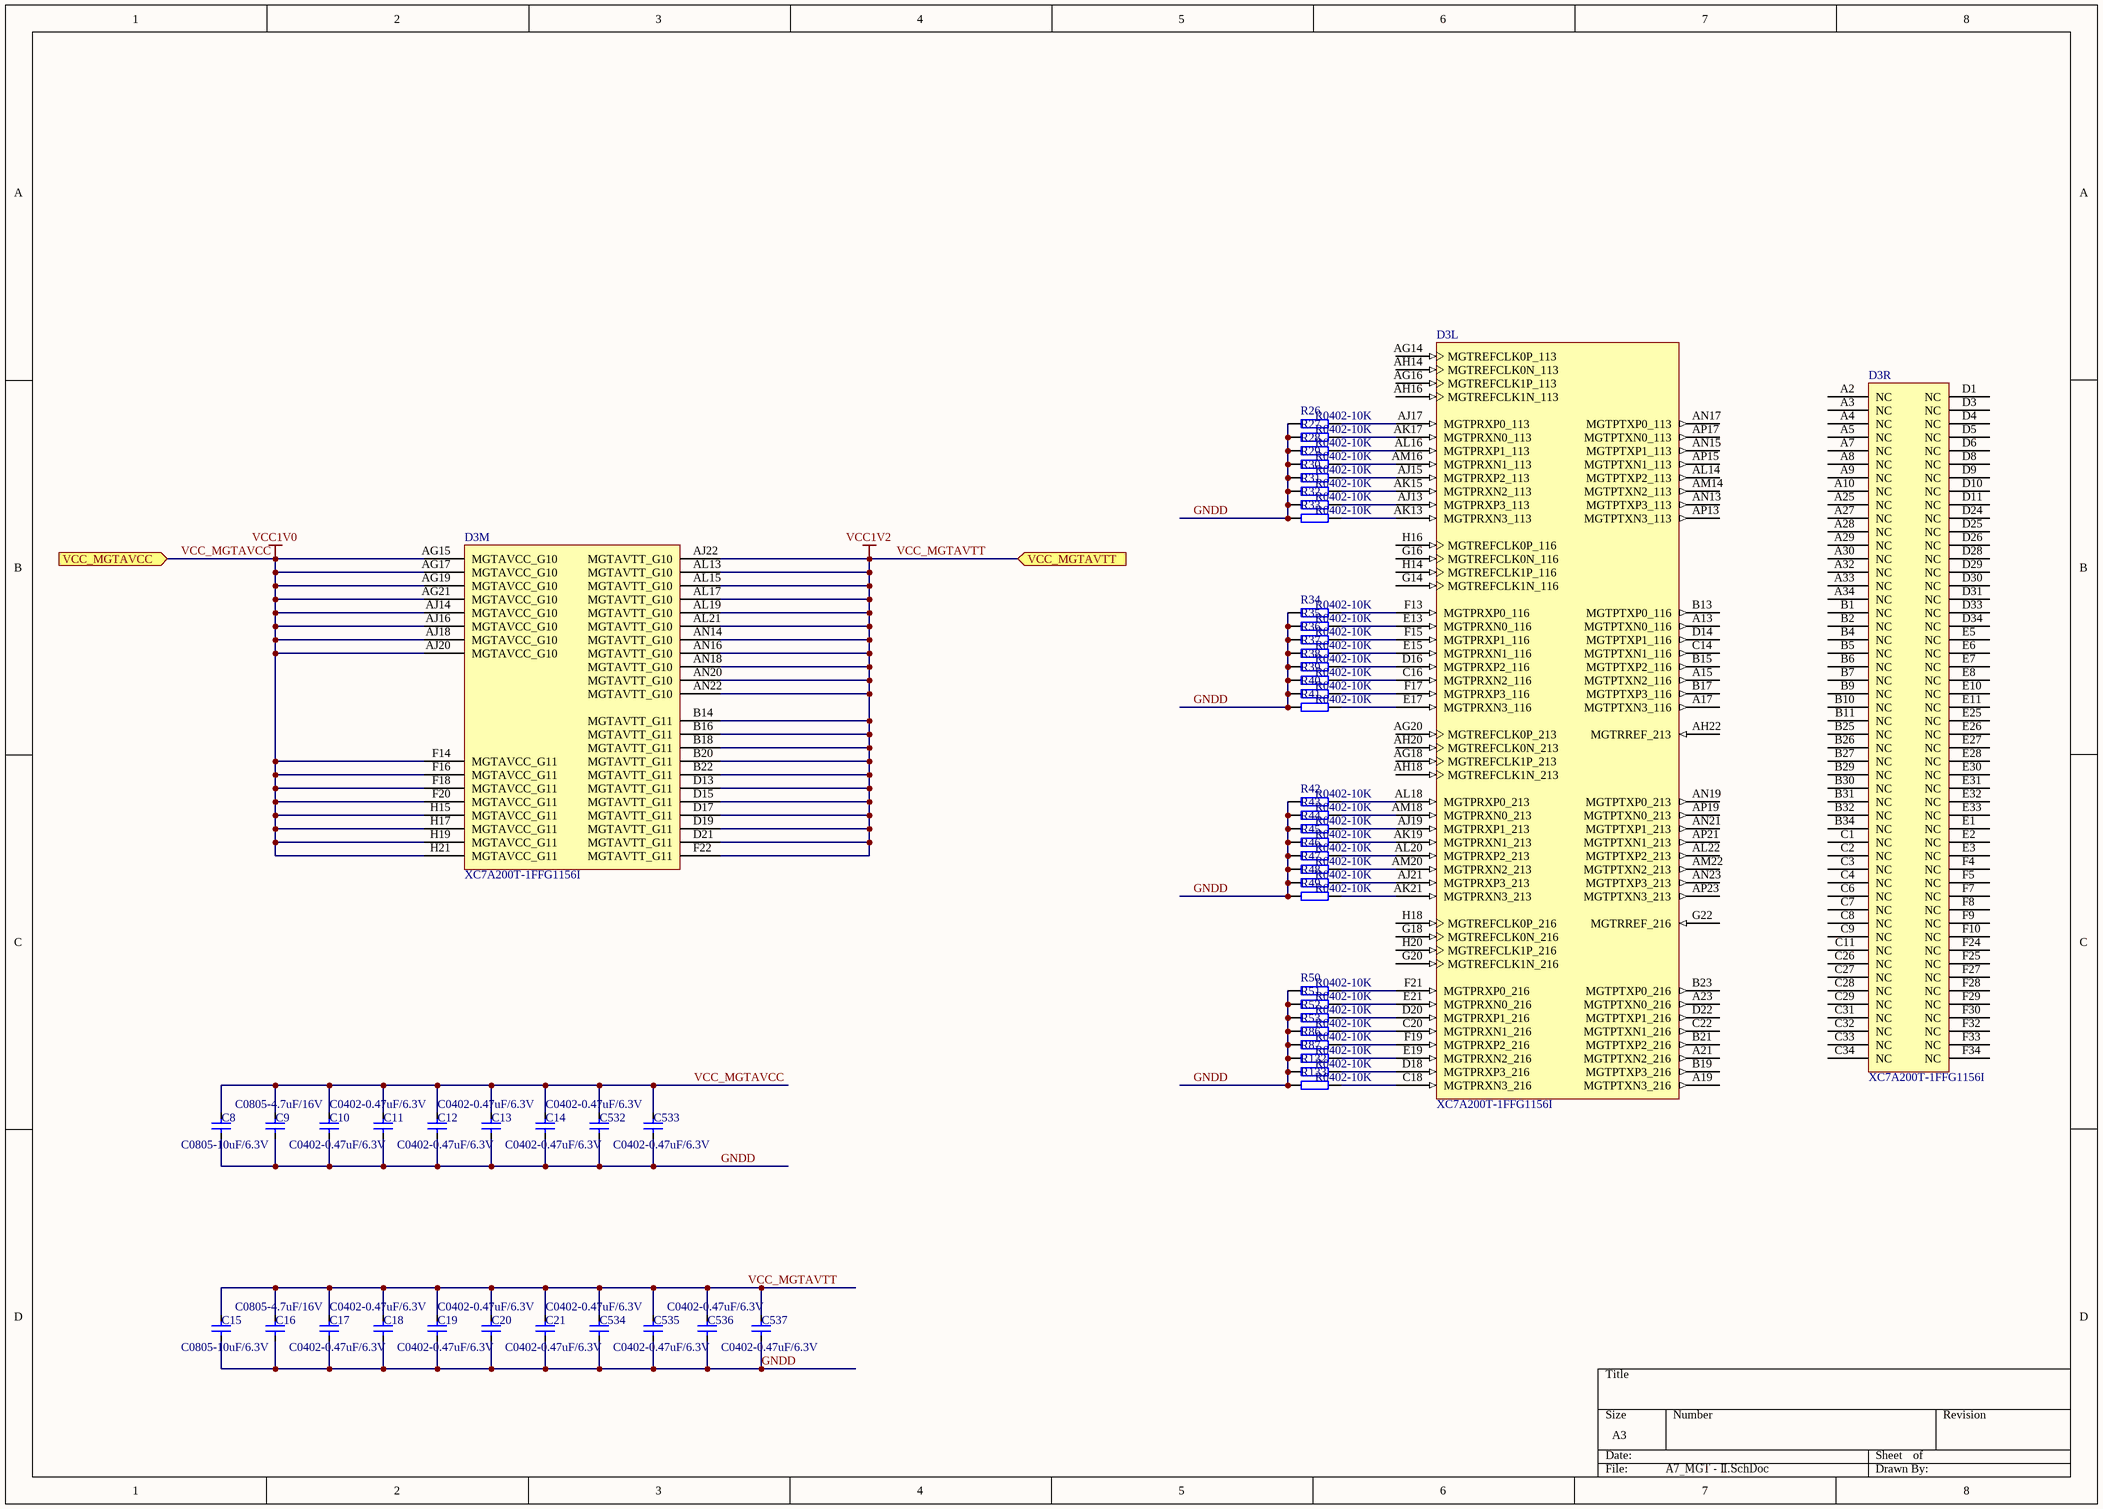
[diagram p14: A7_MGT - Ⅱ.SchDoc]

### Parts
C8  C0805-10uF/6.3V  [C0805]
C9  C0805-4.7uF/16V  [C0805]
C10  C0402-0.47uF/6.3V  [C0402]
C11  C0402-0.47uF/6.3V  [C0402]
C12  C0402-0.47uF/6.3V  [C0402]
C13  C0402-0.47uF/6.3V  [C0402]
C14  C0402-0.47uF/6.3V  [C0402]
C15  C0805-10uF/6.3V  [C0805]
C16  C0805-4.7uF/16V  [C0805]
C17  C0402-0.47uF/6.3V  [C0402]
C18  C0402-0.47uF/6.3V  [C0402]
C19  C0402-0.47uF/6.3V  [C0402]
C20  C0402-0.47uF/6.3V  [C0402]
C21  C0402-0.47uF/6.3V  [C0402]
C532  C0402-0.47uF/6.3V  [C0402]
C533  C0402-0.47uF/6.3V  [C0402]
C534  C0402-0.47uF/6.3V  [C0402]
C535  C0402-0.47uF/6.3V  [C0402]
C536  C0402-0.47uF/6.3V  [C0402]
C537  C0402-0.47uF/6.3V  [C0402]
D3  XC7A200T-1FFG1156I  [FFG1156]  (parts L,M,R of 18)
R26  R0402-10K  [R0402]
R27  R0402-10K  [R0402]
R28  R0402-10K  [R0402]
R29  R0402-10K  [R0402]
R30  R0402-10K  [R0402]
R31  R0402-10K  [R0402]
R32  R0402-10K  [R0402]
R33  R0402-10K  [R0402]
R34  R0402-10K  [R0402]
R35  R0402-10K  [R0402]
R36  R0402-10K  [R0402]
R37  R0402-10K  [R0402]
R38  R0402-10K  [R0402]
R39  R0402-10K  [R0402]
R40  R0402-10K  [R0402]
R41  R0402-10K  [R0402]
R42  R0402-10K  [R0402]
R43  R0402-10K  [R0402]
R44  R0402-10K  [R0402]
R45  R0402-10K  [R0402]
R46  R0402-10K  [R0402]
R47  R0402-10K  [R0402]
R48  R0402-10K  [R0402]
R49  R0402-10K  [R0402]
R50  R0402-10K  [R0402]
R51  R0402-10K  [R0402]
R52  R0402-10K  [R0402]
R53  R0402-10K  [R0402]
R86  R0402-10K  [R0402]
R87  R0402-10K  [R0402]
R132  R0402-10K  [R0402]
R133  R0402-10K  [R0402]

### Ports
VCC_MGTAVCC (in), VCC_MGTAVTT (in)

### Nets
GNDD: C8.2 C9.2 C10.2 C11.2 C12.2 C13.2 C14.2 C15.2 C16.2 C17.2 C18.2 C19.2 C20.2 C21.2 C532.2 C533.2 C534.2 C535.2 C536.2 C537.2 R26.1 R27.1 R28.1 R29.1 R30.1 R31.1 R32.1 R33.1 R34.1 R35.1 R36.1 R37.1 R38.1 R39.1 R40.1 R41.1 R42.1 R43.1 R44.1 R45.1 R46.1 R47.1 R48.1 R49.1 R50.1 R51.1 R52.1 R53.1 R86.1 R87.1 R132.1 R133.1
VCC1V0: C8.1 C9.1 C10.1 C11.1 C12.1 C13.1 C14.1 C532.1 C533.1 D3.AG15(MGTAVCC_G10) D3.AG17(MGTAVCC_G10) D3.AG19(MGTAVCC_G10) D3.AG21(MGTAVCC_G10) D3.AJ14(MGTAVCC_G10) D3.AJ16(MGTAVCC_G10) D3.AJ18(MGTAVCC_G10) D3.AJ20(MGTAVCC_G10) D3.F14(MGTAVCC_G11) D3.F16(MGTAVCC_G11) D3.F18(MGTAVCC_G11) D3.F20(MGTAVCC_G11) D3.H15(MGTAVCC_G11) D3.H17(MGTAVCC_G11) D3.H19(MGTAVCC_G11) D3.H21(MGTAVCC_G11) ; port VCC_MGTAVCC  [also labelled VCC_MGTAVCC]
VCC1V2: C15.1 C16.1 C17.1 C18.1 C19.1 C20.1 C21.1 C534.1 C535.1 C536.1 C537.1 D3.AJ22(MGTAVTT_G10) D3.AL13(MGTAVTT_G10) D3.AL15(MGTAVTT_G10) D3.AL17(MGTAVTT_G10) D3.AL19(MGTAVTT_G10) D3.AL21(MGTAVTT_G10) D3.AN14(MGTAVTT_G10) D3.AN16(MGTAVTT_G10) D3.AN18(MGTAVTT_G10) D3.AN20(MGTAVTT_G10) D3.AN22(MGTAVTT_G10) D3.B14(MGTAVTT_G11) D3.B16(MGTAVTT_G11) D3.B18(MGTAVTT_G11) D3.B20(MGTAVTT_G11) D3.B22(MGTAVTT_G11) D3.D13(MGTAVTT_G11) D3.D15(MGTAVTT_G11) D3.D17(MGTAVTT_G11) D3.D19(MGTAVTT_G11) D3.D21(MGTAVTT_G11) D3.F22(MGTAVTT_G11) ; port VCC_MGTAVTT  [also labelled VCC_MGTAVTT]
NetD3_AJ13: D3.AJ13(MGTPRXP3_113) R32.2
NetD3_AJ15: D3.AJ15(MGTPRXP2_113) R30.2
NetD3_AJ17: D3.AJ17(MGTPRXP0_113) R26.2
NetD3_AJ19: D3.AJ19(MGTPRXP1_213) R44.2
NetD3_AJ21: D3.AJ21(MGTPRXP3_213) R48.2
NetD3_AK13: D3.AK13(MGTPRXN3_113) R33.2
NetD3_AK15: D3.AK15(MGTPRXN2_113) R31.2
NetD3_AK17: D3.AK17(MGTPRXN0_113) R27.2
NetD3_AK19: D3.AK19(MGTPRXN1_213) R45.2
NetD3_AK21: D3.AK21(MGTPRXN3_213) R49.2
NetD3_AL16: D3.AL16(MGTPRXP1_113) R28.2
NetD3_AL18: D3.AL18(MGTPRXP0_213) R42.2
NetD3_AL20: D3.AL20(MGTPRXP2_213) R46.2
NetD3_AM16: D3.AM16(MGTPRXN1_113) R29.2
NetD3_AM18: D3.AM18(MGTPRXN0_213) R43.2
NetD3_AM20: D3.AM20(MGTPRXN2_213) R47.2
NetD3_C16: D3.C16(MGTPRXN2_116) R39.2
NetD3_C18: D3.C18(MGTPRXN3_216) R133.2
NetD3_C20: D3.C20(MGTPRXN1_216) R53.2
NetD3_D16: D3.D16(MGTPRXP2_116) R38.2
NetD3_D18: D3.D18(MGTPRXP3_216) R132.2
NetD3_D20: D3.D20(MGTPRXP1_216) R52.2
NetD3_E13: D3.E13(MGTPRXN0_116) R35.2
NetD3_E15: D3.E15(MGTPRXN1_116) R37.2
NetD3_E17: D3.E17(MGTPRXN3_116) R41.2
NetD3_E19: D3.E19(MGTPRXN2_216) R87.2
NetD3_E21: D3.E21(MGTPRXN0_216) R51.2
NetD3_F13: D3.F13(MGTPRXP0_116) R34.2
NetD3_F15: D3.F15(MGTPRXP1_116) R36.2
NetD3_F17: D3.F17(MGTPRXP3_116) R40.2
NetD3_F19: D3.F19(MGTPRXP2_216) R86.2
NetD3_F21: D3.F21(MGTPRXP0_216) R50.2

Not connected (* = marked no-connect by the designer): D3 A2(NC) A3(NC) A4(NC) A5(NC) A7(NC) A8(NC) A9(NC) A10(NC) A13(MGTPTXN0_116) A15(MGTPTXN2_116) A17(MGTPTXN3_116) A19(MGTPTXN3_216) A21(MGTPTXN2_216) A23(MGTPTXN0_216) A25(NC) A27(NC) A28(NC) A29(NC) A30(NC) A32(NC) A33(NC) A34(NC) AG14(MGTREFCLK0P_113) AG16(MGTREFCLK1P_113) AG18(MGTREFCLK1P_213) AG20(MGTREFCLK0P_213) AH14(MGTREFCLK0N_113) AH16(MGTREFCLK1N_113) AH18(MGTREFCLK1N_213) AH20(MGTREFCLK0N_213) AH22(MGTRREF_213) AL14(MGTPTXP2_113) AL22(MGTPTXP2_213) AM14(MGTPTXN2_113) AM22(MGTPTXN2_213) AN13(MGTPTXP3_113) AN15(MGTPTXP1_113) AN17(MGTPTXP0_113) AN19(MGTPTXP0_213) AN21(MGTPTXP1_213) AN23(MGTPTXP3_213) AP13(MGTPTXN3_113) AP15(MGTPTXN1_113) AP17(MGTPTXN0_113) AP19(MGTPTXN0_213) AP21(MGTPTXN1_213) AP23(MGTPTXN3_213) B1(NC) B2(NC) B4(NC) B5(NC) B6(NC) B7(NC) B9(NC) B10(NC) B11(NC) B13(MGTPTXP0_116) B15(MGTPTXP2_116) B17(MGTPTXP3_116) B19(MGTPTXP3_216) B21(MGTPTXP2_216) B23(MGTPTXP0_216) B25(NC) B26(NC) B27(NC) B29(NC) B30(NC) B31(NC) B32(NC) B34(NC) C1(NC) C2(NC) C3(NC) C4(NC) C6(NC) C7(NC) C8(NC) C9(NC) C11(NC) C14(MGTPTXN1_116) C22(MGTPTXN1_216) C26(NC) C27(NC) C28(NC) C29(NC) C31(NC) C32(NC) C33(NC) C34(NC) D1(NC) D3(NC) D4(NC) D5(NC) D6(NC) D8(NC) D9(NC) D10(NC) D11(NC) D14(MGTPTXP1_116) D22(MGTPTXP1_216) D24(NC) D25(NC) D26(NC) D28(NC) D29(NC) D30(NC) D31(NC) D33(NC) D34(NC) E1(NC) E2(NC) E3(NC) E5(NC) E6(NC) E7(NC) E8(NC) E10(NC) E11(NC) E25(NC) E26(NC) E27(NC) E28(NC) E30(NC) E31(NC) E32(NC) E33(NC) F4(NC) F5(NC) F7(NC) F8(NC) F9(NC) F10(NC) F24(NC) F25(NC) F27(NC) F28(NC) F29(NC) F30(NC) F32(NC) F33(NC) F34(NC) G14(MGTREFCLK1N_116) G16(MGTREFCLK0N_116) G18(MGTREFCLK0N_216) G20(MGTREFCLK1N_216) G22(MGTRREF_216) H14(MGTREFCLK1P_116) H16(MGTREFCLK0P_116) H18(MGTREFCLK0P_216) H20(MGTREFCLK1P_216)

### Library data of the parts
C8 C15 = C1210-22uF/16V: Part_number: C0805-10uF/6.3V; Part_type: CAP; Value: C0805-10uF/6.3V; Schematic_Part: CAP; PCB_Footprint: C0805
C9 C16 = C0805-4.7uF/50V: X7R; Manufacturer: SAMSUNG; Part_number: C0805-4.7uF/16V; Part_type: CAP; Value: C0805-4.7uF/16V; Schematic_Part: CAP; PCB_Footprint: C0805; datasheet: #DataSheet\C_Samsung_General Capacitors.pdf#
C10-C14 C17-C21 C532-C537 = C0402-0.1uF/16V: as C3 on sheet A7_JTAG&CONFIG - Ⅱ; Part_number: C0402-0.47uF/6.3V; Part_type: CAP; Value: C0402-0.47uF/6.3V; temperature: -55℃\+125℃; Schematic_Part: CAP; PCB_Footprint: C0402; datasheet: #DataSheet\C_Samsung_General Capacitors.pdf#
D3 = XC7A200T-1FFG1156I: as D3 on sheet A7_FUNCTION2 - Ⅱ; DatasheetVersion: v1.12; PackageVersion: Rev 1.8; PackageReference: FFG1156; PackageDescription: Flip-Chip BGA, Body 35 x 35 mm, 1.0 mm Pitch; CLBs (Max Distributed RAM Kb): 2888; Generic Part Number: XC7A200T; RoHS: Pb-Free; Mounting Technology: Surface Mount; Code_JEDEC: MS-034-AAR-1; PartNumber: XC7A200T-1FFG1156I; ComponentLink1Description: Datasheet; ComponentLink1URL: http://www.xilinx.com/support/documentation/data_sheets/ds180_7Series_Overview.pdf; ComponentLink2Description: Package Specification; ComponentLink2URL: http://www.xilinx.com/support/documentation/user_guides/ug475_7Series_Pkg_Pinout.pdf; ComponentLink3Description: DC and Switching Characteristics; ComponentLink3URL: http://www.xilinx.com/support/documentation/data_sheets/ds181_Artix_7_Data_Sheet.pdf; ComponentLink4Description: Package File; ComponentLink4URL: http://www.xilinx.com/support/packagefiles/a7packages/xc7a200tfbg676pkg.txt; ComponentLink5Description: Packaging and Pinout; ComponentLink5URL: http://www.xilinx.com/support/documentation/user_guides/ug475_7Series_Pkg_Pinout.pdf
R26-R53 R86 R87 R132 R133 = R0402-10K: Manufacturer: SAMSUNG; Part_number: R0402-10K; Part_type: RES; Value: R0402-10K; Schematic_Part: RES; PCB_Footprint: R0402

## Sheet A7_POWER - Ⅱ.SchDoc
size A3
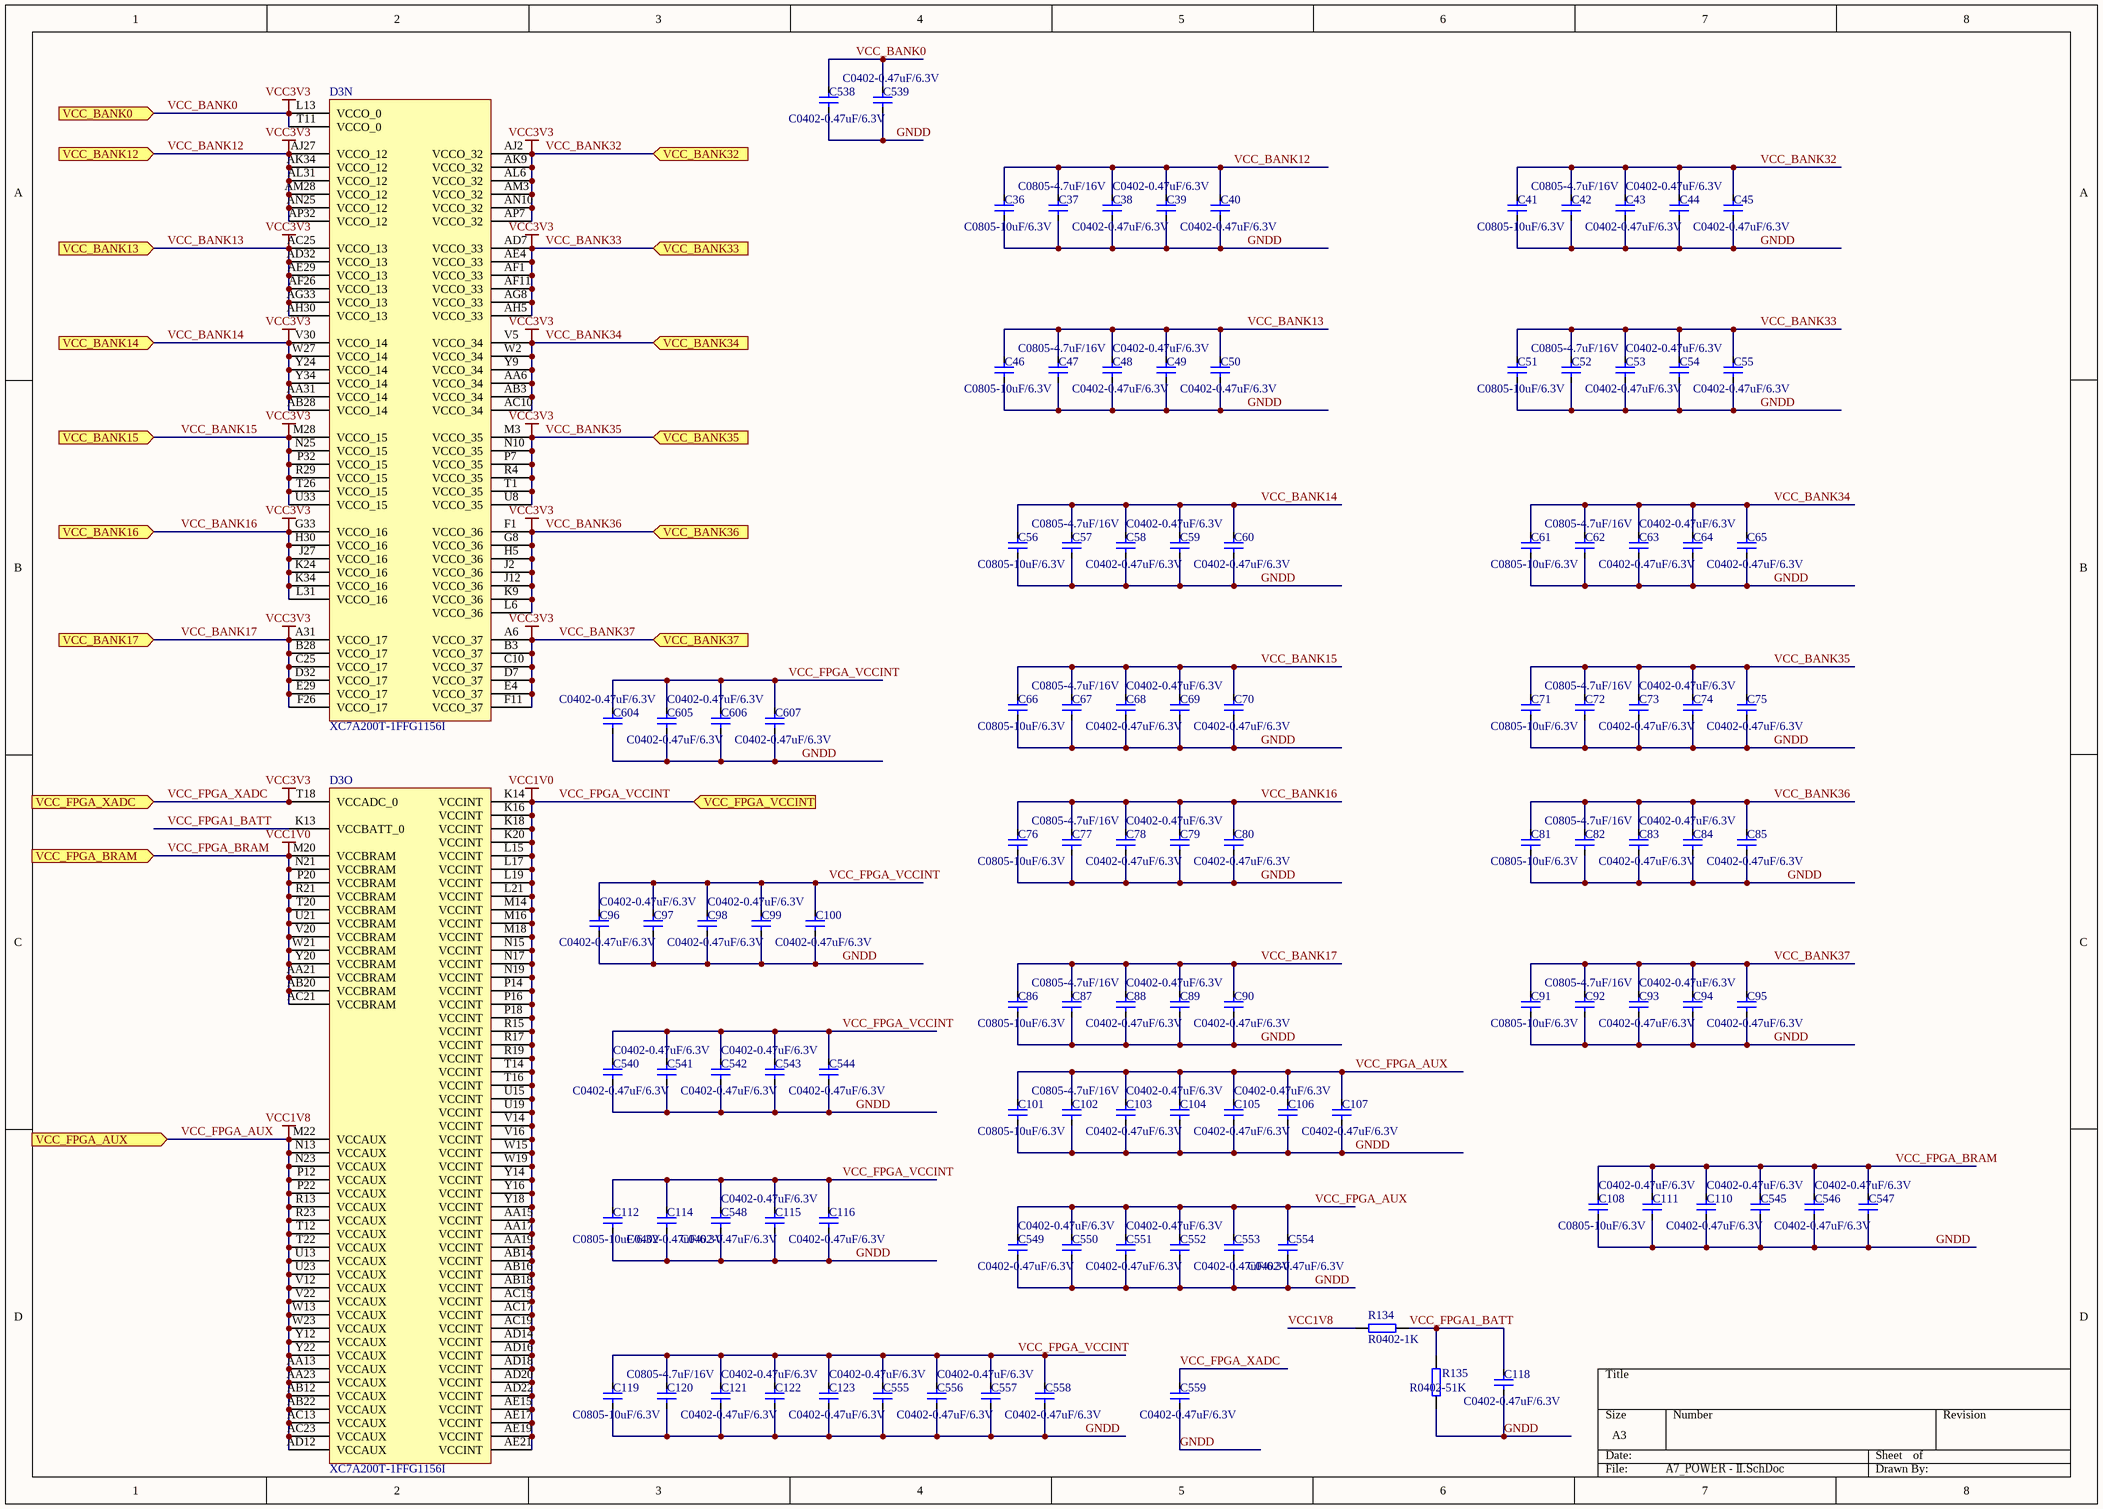
[diagram p15: A7_POWER - Ⅱ.SchDoc]

### Parts
C36  C0805-10uF/6.3V  [C0805]
C37  C0805-4.7uF/16V  [C0805]
C38  C0402-0.47uF/6.3V  [C0402]
C39  C0402-0.47uF/6.3V  [C0402]
C40  C0402-0.47uF/6.3V  [C0402]
C41  C0805-10uF/6.3V  [C0805]
C42  C0805-4.7uF/16V  [C0805]
C43  C0402-0.47uF/6.3V  [C0402]
C44  C0402-0.47uF/6.3V  [C0402]
C45  C0402-0.47uF/6.3V  [C0402]
C46  C0805-10uF/6.3V  [C0805]
C47  C0805-4.7uF/16V  [C0805]
C48  C0402-0.47uF/6.3V  [C0402]
C49  C0402-0.47uF/6.3V  [C0402]
C50  C0402-0.47uF/6.3V  [C0402]
C51  C0805-10uF/6.3V  [C0805]
C52  C0805-4.7uF/16V  [C0805]
C53  C0402-0.47uF/6.3V  [C0402]
C54  C0402-0.47uF/6.3V  [C0402]
C55  C0402-0.47uF/6.3V  [C0402]
C56  C0805-10uF/6.3V  [C0805]
C57  C0805-4.7uF/16V  [C0805]
C58  C0402-0.47uF/6.3V  [C0402]
C59  C0402-0.47uF/6.3V  [C0402]
C60  C0402-0.47uF/6.3V  [C0402]
C61  C0805-10uF/6.3V  [C0805]
C62  C0805-4.7uF/16V  [C0805]
C63  C0402-0.47uF/6.3V  [C0402]
C64  C0402-0.47uF/6.3V  [C0402]
C65  C0402-0.47uF/6.3V  [C0402]
C66  C0805-10uF/6.3V  [C0805]
C67  C0805-4.7uF/16V  [C0805]
C68  C0402-0.47uF/6.3V  [C0402]
C69  C0402-0.47uF/6.3V  [C0402]
C70  C0402-0.47uF/6.3V  [C0402]
C71  C0805-10uF/6.3V  [C0805]
C72  C0805-4.7uF/16V  [C0805]
C73  C0402-0.47uF/6.3V  [C0402]
C74  C0402-0.47uF/6.3V  [C0402]
C75  C0402-0.47uF/6.3V  [C0402]
C76  C0805-10uF/6.3V  [C0805]
C77  C0805-4.7uF/16V  [C0805]
C78  C0402-0.47uF/6.3V  [C0402]
C79  C0402-0.47uF/6.3V  [C0402]
C80  C0402-0.47uF/6.3V  [C0402]
C81  C0805-10uF/6.3V  [C0805]
C82  C0805-4.7uF/16V  [C0805]
C83  C0402-0.47uF/6.3V  [C0402]
C84  C0402-0.47uF/6.3V  [C0402]
C85  C0402-0.47uF/6.3V  [C0402]
C86  C0805-10uF/6.3V  [C0805]
C87  C0805-4.7uF/16V  [C0805]
C88  C0402-0.47uF/6.3V  [C0402]
C89  C0402-0.47uF/6.3V  [C0402]
C90  C0402-0.47uF/6.3V  [C0402]
C91  C0805-10uF/6.3V  [C0805]
C92  C0805-4.7uF/16V  [C0805]
C93  C0402-0.47uF/6.3V  [C0402]
C94  C0402-0.47uF/6.3V  [C0402]
C95  C0402-0.47uF/6.3V  [C0402]
C96  C0402-0.47uF/6.3V  [C0402]
C97  C0402-0.47uF/6.3V  [C0402]
C98  C0402-0.47uF/6.3V  [C0402]
C99  C0402-0.47uF/6.3V  [C0402]
C100  C0402-0.47uF/6.3V  [C0402]
C101  C0805-10uF/6.3V  [C0805]
C102  C0805-4.7uF/16V  [C0805]
C103  C0402-0.47uF/6.3V  [C0402]
C104  C0402-0.47uF/6.3V  [C0402]
C105  C0402-0.47uF/6.3V  [C0402]
C106  C0402-0.47uF/6.3V  [C0402]
C107  C0402-0.47uF/6.3V  [C0402]
C108  C0805-10uF/6.3V  [C0805]
C110  C0402-0.47uF/6.3V  [C0402]
C111  C0402-0.47uF/6.3V  [C0402]
C112  C0805-10uF/6.3V  [C0805]
C114  C0402-0.47uF/6.3V  [C0402]
C115  C0402-0.47uF/6.3V  [C0402]
C116  C0402-0.47uF/6.3V  [C0402]
C118  C0402-0.47uF/6.3V  [C0402]
C119  C0805-10uF/6.3V  [C0805]
C120  C0805-4.7uF/16V  [C0805]
C121  C0402-0.47uF/6.3V  [C0402]
C122  C0402-0.47uF/6.3V  [C0402]
C123  C0402-0.47uF/6.3V  [C0402]
C538  C0402-0.47uF/6.3V  [C0402]
C539  C0402-0.47uF/6.3V  [C0402]
C540  C0402-0.47uF/6.3V  [C0402]
C541  C0402-0.47uF/6.3V  [C0402]
C542  C0402-0.47uF/6.3V  [C0402]
C543  C0402-0.47uF/6.3V  [C0402]
C544  C0402-0.47uF/6.3V  [C0402]
C545  C0402-0.47uF/6.3V  [C0402]
C546  C0402-0.47uF/6.3V  [C0402]
C547  C0402-0.47uF/6.3V  [C0402]
C548  C0402-0.47uF/6.3V  [C0402]
C549  C0402-0.47uF/6.3V  [C0402]
C550  C0402-0.47uF/6.3V  [C0402]
C551  C0402-0.47uF/6.3V  [C0402]
C552  C0402-0.47uF/6.3V  [C0402]
C553  C0402-0.47uF/6.3V  [C0402]
C554  C0402-0.47uF/6.3V  [C0402]
C555  C0402-0.47uF/6.3V  [C0402]
C556  C0402-0.47uF/6.3V  [C0402]
C557  C0402-0.47uF/6.3V  [C0402]
C558  C0402-0.47uF/6.3V  [C0402]
C559  C0402-0.47uF/6.3V  [C0402]
C604  C0402-0.47uF/6.3V  [C0402]
C605  C0402-0.47uF/6.3V  [C0402]
C606  C0402-0.47uF/6.3V  [C0402]
C607  C0402-0.47uF/6.3V  [C0402]
D3  XC7A200T-1FFG1156I  [FFG1156]  (parts N,O of 18)
R134  R0402-1K  [R0402]
R135  R0402-51K  [R0402]

### Ports
VCC_BANK0 (in), VCC_BANK12 (in), VCC_BANK13 (in), VCC_BANK14 (in), VCC_BANK15 (in), VCC_BANK16 (in), VCC_BANK17 (in), VCC_BANK32 (in), VCC_BANK33 (in), VCC_BANK34 (in), VCC_BANK35 (in), VCC_BANK36 (in), VCC_BANK37 (in), VCC_FPGA_AUX (in), VCC_FPGA_BRAM (in), VCC_FPGA_VCCINT (in), VCC_FPGA_XADC (in)

### Nets
GNDD: C36.2 C37.2 C38.2 C39.2 C40.2 C41.2 C42.2 C43.2 C44.2 C45.2 C46.2 C47.2 C48.2 C49.2 C50.2 C51.2 C52.2 C53.2 C54.2 C55.2 C56.2 C57.2 C58.2 C59.2 C60.2 C61.2 C62.2 C63.2 C64.2 C65.2 C66.2 C67.2 C68.2 C69.2 C70.2 C71.2 C72.2 C73.2 C74.2 C75.2 C76.2 C77.2 C78.2 C79.2 C80.2 C81.2 C82.2 C83.2 C84.2 C85.2 C86.2 C87.2 C88.2 C89.2 C90.2 C91.2 C92.2 C93.2 C94.2 C95.2 C96.2 C97.2 C98.2 C99.2 C100.2 C101.2 C102.2 C103.2 C104.2 C105.2 C106.2 C107.2 C108.2 C110.2 C111.2 C112.2 C114.2 C115.2 C116.2 C118.2 C119.2 C120.2 C121.2 C122.2 C123.2 C538.2 C539.2 C540.2 C541.2 C542.2 C543.2 C544.2 C545.2 C546.2 C547.2 C548.2 C549.2 C550.2 C551.2 C552.2 C553.2 C554.2 C555.2 C556.2 C557.2 C558.2 C559.2 C604.2 C605.2 C606.2 C607.2 R135.1
VCC1V0: C96.1 C97.1 C98.1 C99.1 C100.1 C108.1 C110.1 C111.1 C112.1 C114.1 C115.1 C116.1 C119.1 C120.1 C121.1 C122.1 C123.1 C540.1 C541.1 C542.1 C543.1 C544.1 C545.1 C546.1 C547.1 C548.1 C555.1 C556.1 C557.1 C558.1 C604.1 C605.1 C606.1 C607.1 D3.AA15(VCCINT) D3.AA17(VCCINT) D3.AA19(VCCINT) D3.AA21(VCCBRAM) D3.AB14(VCCINT) D3.AB16(VCCINT) D3.AB18(VCCINT) D3.AB20(VCCBRAM) D3.AC15(VCCINT) D3.AC17(VCCINT) D3.AC19(VCCINT) D3.AC21(VCCBRAM) D3.AD14(VCCINT) D3.AD16(VCCINT) D3.AD18(VCCINT) D3.AD20(VCCINT) D3.AD22(VCCINT) D3.AE15(VCCINT) D3.AE17(VCCINT) D3.AE19(VCCINT) D3.AE21(VCCINT) D3.K14(VCCINT) D3.K16(VCCINT) D3.K18(VCCINT) D3.K20(VCCINT) D3.L15(VCCINT) D3.L17(VCCINT) D3.L19(VCCINT) D3.L21(VCCINT) D3.M14(VCCINT) D3.M16(VCCINT) D3.M18(VCCINT) D3.M20(VCCBRAM) D3.N15(VCCINT) D3.N17(VCCINT) D3.N19(VCCINT) D3.N21(VCCBRAM) D3.P14(VCCINT) D3.P16(VCCINT) D3.P18(VCCINT) D3.P20(VCCBRAM) D3.R15(VCCINT) D3.R17(VCCINT) D3.R19(VCCINT) D3.R21(VCCBRAM) D3.T14(VCCINT) D3.T16(VCCINT) D3.T20(VCCBRAM) D3.U15(VCCINT) D3.U19(VCCINT) D3.U21(VCCBRAM) D3.V14(VCCINT) D3.V16(VCCINT) D3.V20(VCCBRAM) D3.W15(VCCINT) D3.W19(VCCINT) D3.W21(VCCBRAM) D3.Y14(VCCINT) D3.Y16(VCCINT) D3.Y18(VCCINT) D3.Y20(VCCBRAM) ; port VCC_FPGA_BRAM, port VCC_FPGA_VCCINT  [also labelled VCC_FPGA_BRAM, VCC_FPGA_VCCINT]
VCC1V8: C101.1 C102.1 C103.1 C104.1 C105.1 C106.1 C107.1 C549.1 C550.1 C551.1 C552.1 C553.1 C554.1 D3.AA13(VCCAUX) D3.AA23(VCCAUX) D3.AB12(VCCAUX) D3.AB22(VCCAUX) D3.AC13(VCCAUX) D3.AC23(VCCAUX) D3.AD12(VCCAUX) D3.M22(VCCAUX) D3.N13(VCCAUX) D3.N23(VCCAUX) D3.P12(VCCAUX) D3.P22(VCCAUX) D3.R13(VCCAUX) D3.R23(VCCAUX) D3.T12(VCCAUX) D3.T22(VCCAUX) D3.U13(VCCAUX) D3.U23(VCCAUX) D3.V12(VCCAUX) D3.V22(VCCAUX) D3.W13(VCCAUX) D3.W23(VCCAUX) D3.Y12(VCCAUX) D3.Y22(VCCAUX) R134.2 ; port VCC_FPGA_AUX  [also labelled VCC_FPGA_AUX]
VCC3V3: C36.1 C37.1 C38.1 C39.1 C40.1 C41.1 C42.1 C43.1 C44.1 C45.1 C46.1 C47.1 C48.1 C49.1 C50.1 C51.1 C52.1 C53.1 C54.1 C55.1 C56.1 C57.1 C58.1 C59.1 C60.1 C61.1 C62.1 C63.1 C64.1 C65.1 C66.1 C67.1 C68.1 C69.1 C70.1 C71.1 C72.1 C73.1 C74.1 C75.1 C76.1 C77.1 C78.1 C79.1 C80.1 C81.1 C82.1 C83.1 C84.1 C85.1 C86.1 C87.1 C88.1 C89.1 C90.1 C91.1 C92.1 C93.1 C94.1 C95.1 C538.1 C539.1 C559.1 D3.A6(VCCO_37) D3.A31(VCCO_17) D3.AA6(VCCO_34) D3.AA31(VCCO_14) D3.AB3(VCCO_34) D3.AB28(VCCO_14) D3.AC10(VCCO_34) D3.AC25(VCCO_13) D3.AD7(VCCO_33) D3.AD32(VCCO_13) D3.AE4(VCCO_33) D3.AE29(VCCO_13) D3.AF1(VCCO_33) D3.AF11(VCCO_33) D3.AF26(VCCO_13) D3.AG8(VCCO_33) D3.AG33(VCCO_13) D3.AH5(VCCO_33) D3.AH30(VCCO_13) D3.AJ2(VCCO_32) D3.AJ27(VCCO_12) D3.AK9(VCCO_32) D3.AK34(VCCO_12) D3.AL6(VCCO_32) D3.AL31(VCCO_12) D3.AM3(VCCO_32) D3.AM28(VCCO_12) D3.AN10(VCCO_32) D3.AN25(VCCO_12) D3.AP7(VCCO_32) D3.AP32(VCCO_12) D3.B3(VCCO_37) D3.B28(VCCO_17) D3.C10(VCCO_37) D3.C25(VCCO_17) D3.D7(VCCO_37) D3.D32(VCCO_17) D3.E4(VCCO_37) D3.E29(VCCO_17) D3.F1(VCCO_36) D3.F11(VCCO_37) D3.F26(VCCO_17) D3.G8(VCCO_36) D3.G33(VCCO_16) D3.H5(VCCO_36) D3.H30(VCCO_16) D3.J2(VCCO_36) D3.J12(VCCO_36) D3.J27(VCCO_16) D3.K9(VCCO_36) D3.K24(VCCO_16) D3.K34(VCCO_16) D3.L6(VCCO_36) D3.L13(VCCO_0) D3.L31(VCCO_16) D3.M3(VCCO_35) D3.M28(VCCO_15) D3.N10(VCCO_35) D3.N25(VCCO_15) D3.P7(VCCO_35) D3.P32(VCCO_15) D3.R4(VCCO_35) D3.R29(VCCO_15) D3.T1(VCCO_35) D3.T11(VCCO_0) D3.T18(VCCADC_0) D3.T26(VCCO_15) D3.U8(VCCO_35) D3.U33(VCCO_15) D3.V5(VCCO_34) D3.V30(VCCO_14) D3.W2(VCCO_34) D3.W27(VCCO_14) D3.Y9(VCCO_34) D3.Y24(VCCO_14) D3.Y34(VCCO_14) ; port VCC_BANK0, port VCC_BANK12, port VCC_BANK13, port VCC_BANK14, port VCC_BANK15, port VCC_BANK16, port VCC_BANK17, port VCC_FPGA_XADC, port VCC_BANK32, port VCC_BANK33, port VCC_BANK34, port VCC_BANK35, port VCC_BANK36, port VCC_BANK37  [also labelled VCC_BANK0, VCC_BANK12, VCC_BANK13, VCC_BANK14, VCC_BANK15, VCC_BANK16, VCC_BANK17, VCC_BANK32, VCC_BANK33, VCC_BANK34, VCC_BANK35, VCC_BANK36, VCC_BANK37, VCC_FPGA_XADC]
VCC_FPGA1_BATT: C118.1 D3.K13(VCCBATT_0) R134.1 R135.2

### Library data of the parts
C36 C41 C46 C51 C56 C61 C66 C71 C76 C81 C86 C91 C101 C108 C112 C119 = C1210-22uF/16V: Part_number: C0805-10uF/6.3V; Part_type: CAP; Value: C0805-10uF/6.3V; Schematic_Part: CAP; PCB_Footprint: C0805
C37 C42 C47 C52 C57 C62 C67 C72 C77 C82 C87 C92 C102 C120 = C0805-4.7uF/50V: X7R; Manufacturer: SAMSUNG; Part_number: C0805-4.7uF/16V; Part_type: CAP; Value: C0805-4.7uF/16V; Schematic_Part: CAP; PCB_Footprint: C0805; datasheet: #DataSheet\C_Samsung_General Capacitors.pdf#
C38-C40 C43-C45 C48-C50 C53-C55 C58-C60 C63-C65 C68-C70 C73-C75 C78-C80 C83-C85 C88-C90 C93-C100 C103-C107 C110 C111 C114-C116 C118 C121-C123 C538-C559 C604-C607 = C0402-0.1uF/16V: as C3 on sheet A7_JTAG&CONFIG - Ⅱ; Part_number: C0402-0.47uF/6.3V; Part_type: CAP; Value: C0402-0.47uF/6.3V; temperature: -55℃\+125℃; Schematic_Part: CAP; PCB_Footprint: C0402; datasheet: #DataSheet\C_Samsung_General Capacitors.pdf#
D3 = XC7A200T-1FFG1156I: as D3 on sheet A7_FUNCTION2 - Ⅱ; DatasheetVersion: v1.12; PackageVersion: Rev 1.8; PackageReference: FFG1156; PackageDescription: Flip-Chip BGA, Body 35 x 35 mm, 1.0 mm Pitch; CLBs (Max Distributed RAM Kb): 2888; Generic Part Number: XC7A200T; RoHS: Pb-Free; Mounting Technology: Surface Mount; Code_JEDEC: MS-034-AAR-1; PartNumber: XC7A200T-1FFG1156I; ComponentLink1Description: Datasheet; ComponentLink1URL: http://www.xilinx.com/support/documentation/data_sheets/ds180_7Series_Overview.pdf; ComponentLink2Description: Package Specification; ComponentLink2URL: http://www.xilinx.com/support/documentation/user_guides/ug475_7Series_Pkg_Pinout.pdf; ComponentLink3Description: DC and Switching Characteristics; ComponentLink3URL: http://www.xilinx.com/support/documentation/data_sheets/ds181_Artix_7_Data_Sheet.pdf; ComponentLink4Description: Package File; ComponentLink4URL: http://www.xilinx.com/support/packagefiles/a7packages/xc7a200tfbg676pkg.txt; ComponentLink5Description: Packaging and Pinout; ComponentLink5URL: http://www.xilinx.com/support/documentation/user_guides/ug475_7Series_Pkg_Pinout.pdf
R134 R135 = R0402-10K: Manufacturer: SAMSUNG; Part_type: RES; Schematic_Part: RES; PCB_Footprint: R0402
  R134: Part_number: R0402-1K; Value: R0402-1K
  R135: Part_number: R0402-51K; Value: R0402-51K

## Sheet A7_GND - Ⅱ.SchDoc
size A3
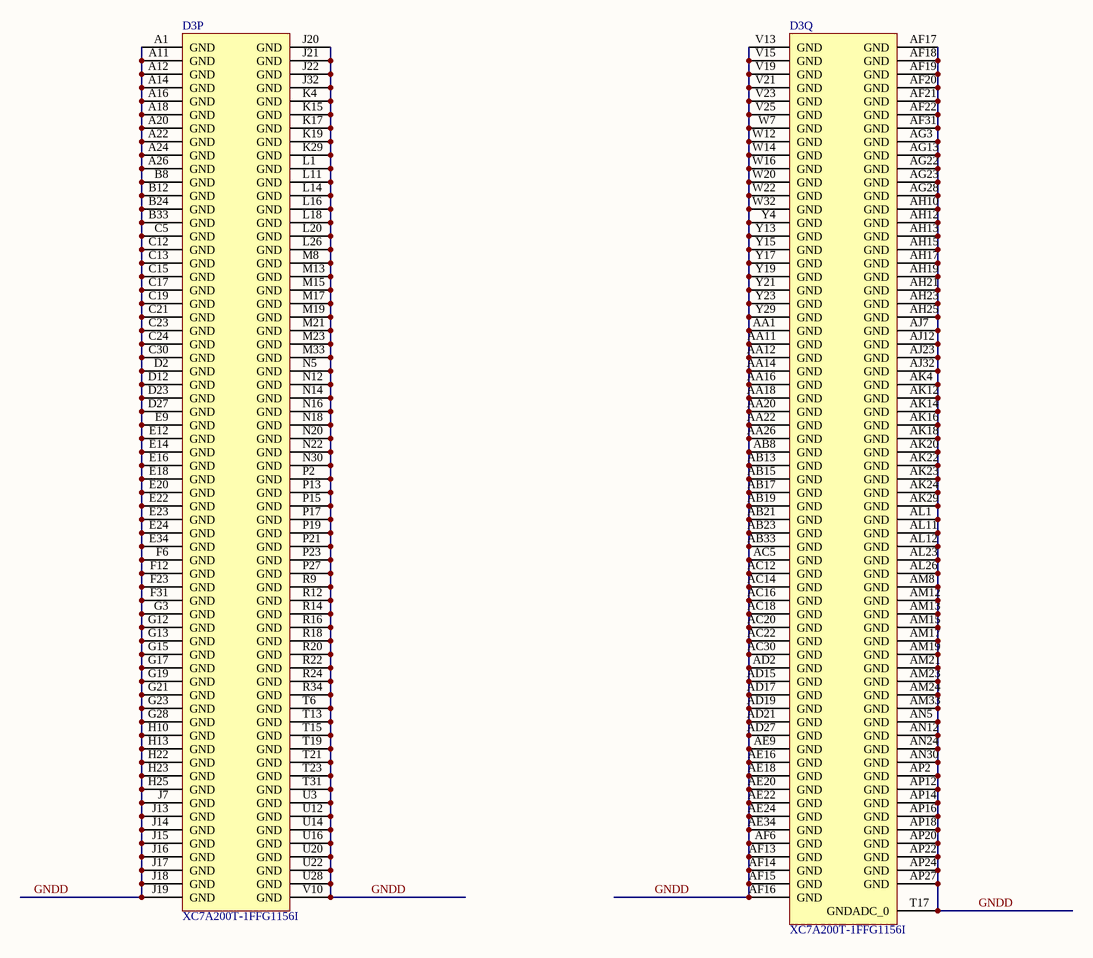
[diagram p16: A7_GND - Ⅱ.SchDoc]

### Parts
D3  XC7A200T-1FFG1156I  [FFG1156]  (parts P,Q of 18)

### Nets
GNDD: D3.A1(GND) D3.A11(GND) D3.A12(GND) D3.A14(GND) D3.A16(GND) D3.A18(GND) D3.A20(GND) D3.A22(GND) D3.A24(GND) D3.A26(GND) D3.AA1(GND) D3.AA11(GND) D3.AA12(GND) D3.AA14(GND) D3.AA16(GND) D3.AA18(GND) D3.AA20(GND) D3.AA22(GND) D3.AA26(GND) D3.AB8(GND) D3.AB13(GND) D3.AB15(GND) D3.AB17(GND) D3.AB19(GND) D3.AB21(GND) D3.AB23(GND) D3.AB33(GND) D3.AC5(GND) D3.AC12(GND) D3.AC14(GND) D3.AC16(GND) D3.AC18(GND) D3.AC20(GND) D3.AC22(GND) D3.AC30(GND) D3.AD2(GND) D3.AD15(GND) D3.AD17(GND) D3.AD19(GND) D3.AD21(GND) D3.AD27(GND) D3.AE9(GND) D3.AE16(GND) D3.AE18(GND) D3.AE20(GND) D3.AE22(GND) D3.AE24(GND) D3.AE34(GND) D3.AF6(GND) D3.AF13(GND) D3.AF14(GND) D3.AF15(GND) D3.AF16(GND) D3.AF17(GND) D3.AF18(GND) D3.AF19(GND) D3.AF20(GND) D3.AF21(GND) D3.AF22(GND) D3.AF31(GND) D3.AG3(GND) D3.AG13(GND) D3.AG22(GND) D3.AG23(GND) D3.AG28(GND) D3.AH10(GND) D3.AH12(GND) D3.AH13(GND) D3.AH15(GND) D3.AH17(GND) D3.AH19(GND) D3.AH21(GND) D3.AH23(GND) D3.AH25(GND) D3.AJ7(GND) D3.AJ12(GND) D3.AJ23(GND) D3.AJ32(GND) D3.AK4(GND) D3.AK12(GND) D3.AK14(GND) D3.AK16(GND) D3.AK18(GND) D3.AK20(GND) D3.AK22(GND) D3.AK23(GND) D3.AK24(GND) D3.AK29(GND) D3.AL1(GND) D3.AL11(GND) D3.AL12(GND) D3.AL23(GND) D3.AL26(GND) D3.AM8(GND) D3.AM12(GND) D3.AM13(GND) D3.AM15(GND) D3.AM17(GND) D3.AM19(GND) D3.AM21(GND) D3.AM23(GND) D3.AM24(GND) D3.AM33(GND) D3.AN5(GND) D3.AN12(GND) D3.AN24(GND) D3.AN30(GND) D3.AP2(GND) D3.AP12(GND) D3.AP14(GND) D3.AP16(GND) D3.AP18(GND) D3.AP20(GND) D3.AP22(GND) D3.AP24(GND) D3.AP27(GND) D3.B8(GND) D3.B12(GND) D3.B24(GND) D3.B33(GND) D3.C5(GND) D3.C12(GND) D3.C13(GND) D3.C15(GND) D3.C17(GND) D3.C19(GND) D3.C21(GND) D3.C23(GND) D3.C24(GND) D3.C30(GND) D3.D2(GND) D3.D12(GND) D3.D23(GND) D3.D27(GND) D3.E9(GND) D3.E12(GND) D3.E14(GND) D3.E16(GND) D3.E18(GND) D3.E20(GND) D3.E22(GND) D3.E23(GND) D3.E24(GND) D3.E34(GND) D3.F6(GND) D3.F12(GND) D3.F23(GND) D3.F31(GND) D3.G3(GND) D3.G12(GND) D3.G13(GND) D3.G15(GND) D3.G17(GND) D3.G19(GND) D3.G21(GND) D3.G23(GND) D3.G28(GND) D3.H10(GND) D3.H13(GND) D3.H22(GND) D3.H23(GND) D3.H25(GND) D3.J7(GND) D3.J13(GND) D3.J14(GND) D3.J15(GND) D3.J16(GND) D3.J17(GND) D3.J18(GND) D3.J19(GND) D3.J20(GND) D3.J21(GND) D3.J22(GND) D3.J32(GND) D3.K4(GND) D3.K15(GND) D3.K17(GND) D3.K19(GND) D3.K29(GND) D3.L1(GND) D3.L11(GND) D3.L14(GND) D3.L16(GND) D3.L18(GND) D3.L20(GND) D3.L26(GND) D3.M8(GND) D3.M13(GND) D3.M15(GND) D3.M17(GND) D3.M19(GND) D3.M21(GND) D3.M23(GND) D3.M33(GND) D3.N5(GND) D3.N12(GND) D3.N14(GND) D3.N16(GND) D3.N18(GND) D3.N20(GND) D3.N22(GND) D3.N30(GND) D3.P2(GND) D3.P13(GND) D3.P15(GND) D3.P17(GND) D3.P19(GND) D3.P21(GND) D3.P23(GND) D3.P27(GND) D3.R9(GND) D3.R12(GND) D3.R14(GND) D3.R16(GND) D3.R18(GND) D3.R20(GND) D3.R22(GND) D3.R24(GND) D3.R34(GND) D3.T6(GND) D3.T13(GND) D3.T15(GND) D3.T17(GNDADC_0) D3.T19(GND) D3.T21(GND) D3.T23(GND) D3.T31(GND) D3.U3(GND) D3.U12(GND) D3.U14(GND) D3.U16(GND) D3.U20(GND) D3.U22(GND) D3.U28(GND) D3.V10(GND) D3.V13(GND) D3.V15(GND) D3.V19(GND) D3.V21(GND) D3.V23(GND) D3.V25(GND) D3.W7(GND) D3.W12(GND) D3.W14(GND) D3.W16(GND) D3.W20(GND) D3.W22(GND) D3.W32(GND) D3.Y4(GND) D3.Y13(GND) D3.Y15(GND) D3.Y17(GND) D3.Y19(GND) D3.Y21(GND) D3.Y23(GND) D3.Y29(GND)

### Library data of the parts
D3 = XC7A200T-1FFG1156I: as D3 on sheet A7_FUNCTION2 - Ⅱ; DatasheetVersion: v1.12; PackageVersion: Rev 1.8; PackageReference: FFG1156; PackageDescription: Flip-Chip BGA, Body 35 x 35 mm, 1.0 mm Pitch; CLBs (Max Distributed RAM Kb): 2888; Generic Part Number: XC7A200T; RoHS: Pb-Free; Mounting Technology: Surface Mount; Code_JEDEC: MS-034-AAR-1; PartNumber: XC7A200T-1FFG1156I; ComponentLink1Description: Datasheet; ComponentLink1URL: http://www.xilinx.com/support/documentation/data_sheets/ds180_7Series_Overview.pdf; ComponentLink2Description: Package Specification; ComponentLink2URL: http://www.xilinx.com/support/documentation/user_guides/ug475_7Series_Pkg_Pinout.pdf; ComponentLink3Description: DC and Switching Characteristics; ComponentLink3URL: http://www.xilinx.com/support/documentation/data_sheets/ds181_Artix_7_Data_Sheet.pdf; ComponentLink4Description: Package File; ComponentLink4URL: http://www.xilinx.com/support/packagefiles/a7packages/xc7a200tfbg676pkg.txt; ComponentLink5Description: Packaging and Pinout; ComponentLink5URL: http://www.xilinx.com/support/documentation/user_guides/ug475_7Series_Pkg_Pinout.pdf

## Sheet POWER_BLOCK.SchDoc
size A4
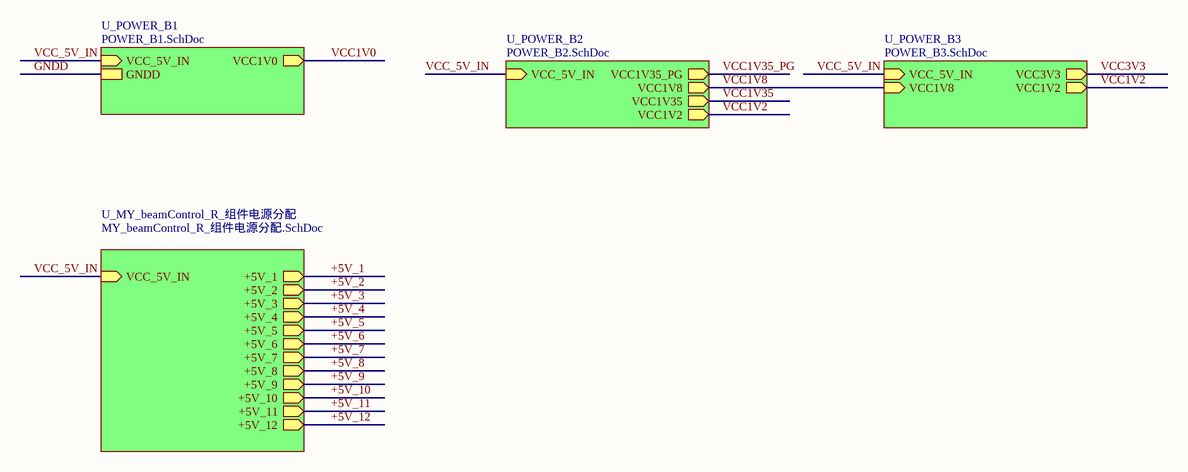
[diagram p17: POWER_BLOCK.SchDoc]

### Sub-sheets
U_MY_beamControl_R_组件电源分配 = MY_beamControl_R_组件电源分配.SchDoc: VCC_5V_IN (in), +5V_1 (out), +5V_2 (out), +5V_3 (out), +5V_4 (out), +5V_5 (out), +5V_6 (out), +5V_7 (out), +5V_8 (out), +5V_9 (out), +5V_10 (out), +5V_11 (out), +5V_12 (out)
U_POWER_B1 = POWER_B1.SchDoc: VCC_5V_IN (in), VCC1V0 (out), GNDD
U_POWER_B2 = POWER_B2.SchDoc: VCC_5V_IN (in), VCC1V35_PG (out), VCC1V8 (out), VCC1V35 (out), VCC1V2 (out)
U_POWER_B3 = POWER_B3.SchDoc: VCC3V3 (out), VCC1V2 (out), VCC_5V_IN (in), VCC1V8 (in)

### Nets
VCC1V2: sheet U_POWER_B2/VCC1V2, sheet U_POWER_B3/VCC1V2
VCC1V8: sheet U_POWER_B2/VCC1V8, sheet U_POWER_B3/VCC1V8
VCC_5V_IN: sheet U_POWER_B1/VCC_5V_IN, sheet U_POWER_B2/VCC_5V_IN, sheet U_POWER_B3/VCC_5V_IN, sheet U_MY_beamControl_R_组件电源分配/VCC_5V_IN

## Sheet POWER_B1.SchDoc
size A3
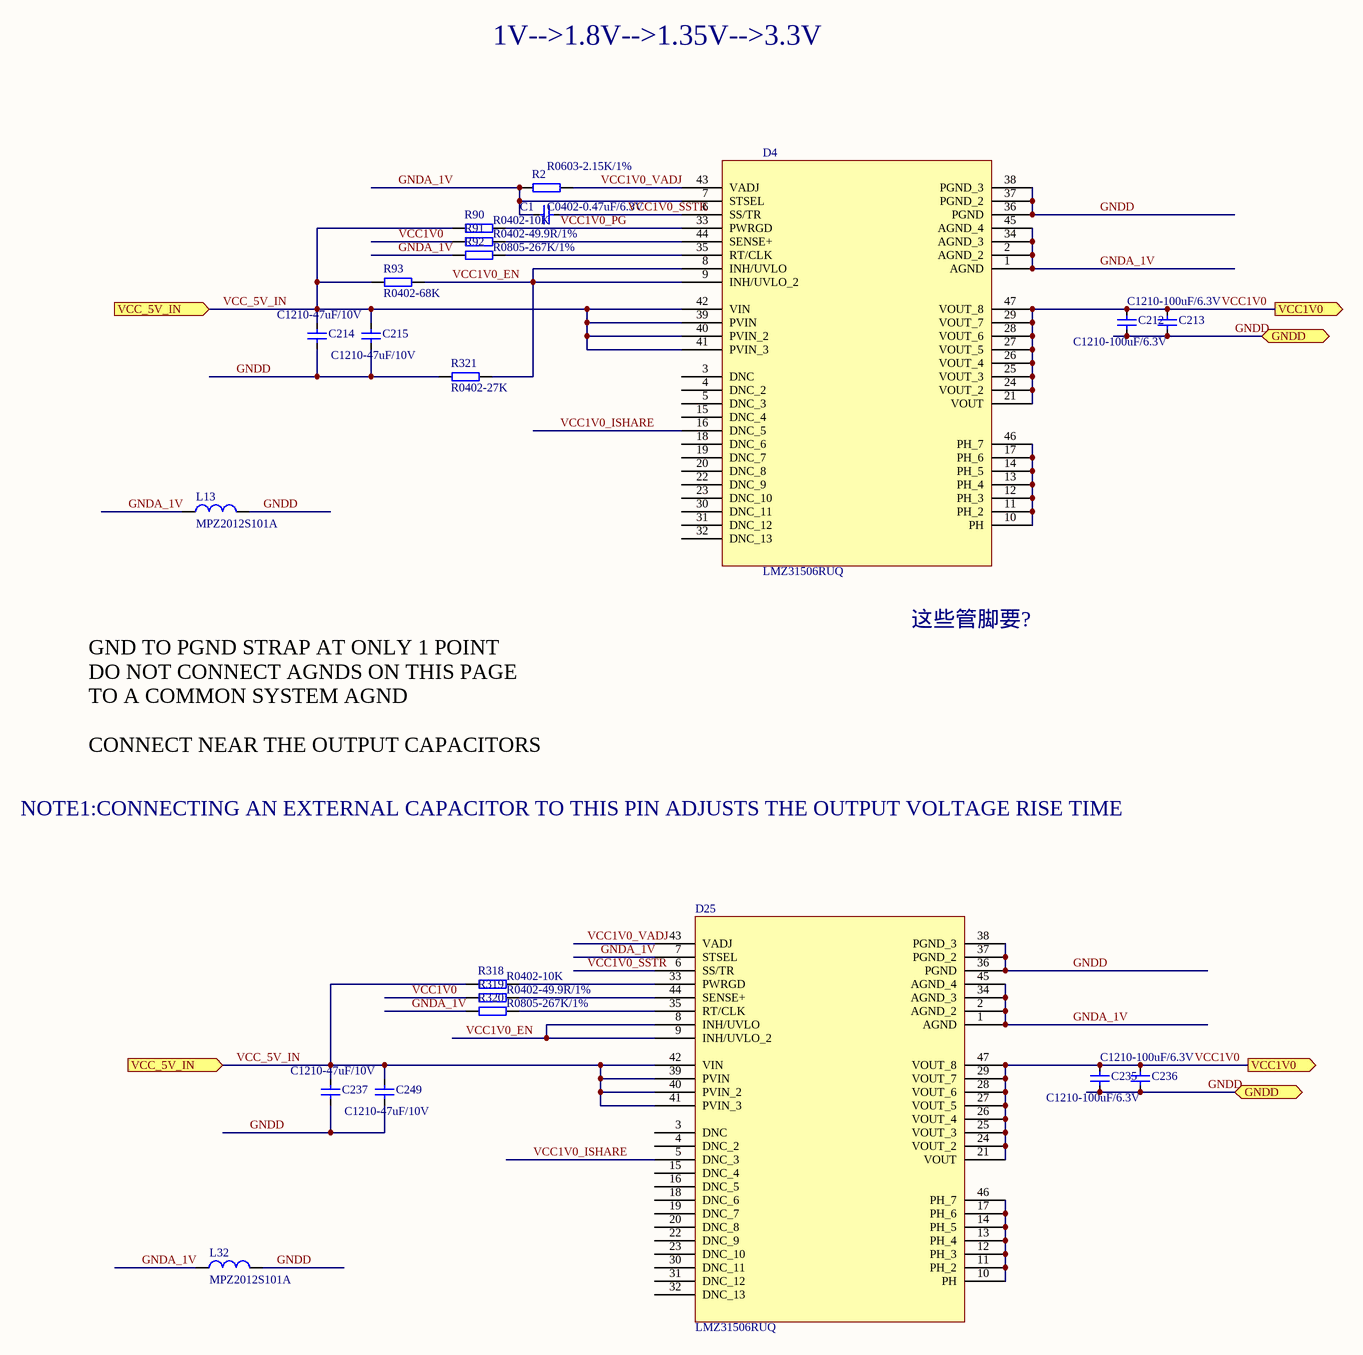
[diagram p18: POWER_B1.SchDoc]

### Parts
C1  C0402-0.47uF/6.3V  [C0402]
C212  C1210-100uF/6.3V  [C1210]
C213  C1210-100uF/6.3V  [C1210]
C214  C1210-47uF/10V  [C1210]
C215  C1210-47uF/10V  [C1210]
C235  C1210-100uF/6.3V  [C1210]
C236  C1210-100uF/6.3V  [C1210]
C237  C1210-47uF/10V  [C1210]
C249  C1210-47uF/10V  [C1210]
D4  LMZ31506RUQ  [RUQ_47]
D25  LMZ31506RUQ  [RUQ_47]
L13  MPZ2012S101A  [R0805]
L32  MPZ2012S101A  [R0805]
R2  R0603-2.15K/1%  [R0603]
R90  R0402-10K  [R0402]
R91  R0402-49.9R/1%  [R0402]
R92  R0805-267K/1%  [R0805]
R93  R0402-68K  [R0402]
R318  R0402-10K  [R0402]
R319  R0402-49.9R/1%  [R0402]
R320  R0805-267K/1%  [R0805]
R321  R0402-27K  [R0402]

### Ports
GNDD, VCC1V0 (out), VCC_5V_IN (in)

### Nets
GNDD: C212.2 C213.2 C214.2 C215.2 C235.2 C236.2 C237.2 C249.2 D4.36(PGND) D4.37(PGND_2) D4.38(PGND_3) D25.36(PGND) D25.37(PGND_2) D25.38(PGND_3) L13.2 L32.2 R321.1 ; port GNDD
VCC1V0: C212.1 C213.1 C235.1 C236.1 D4.21(VOUT) D4.24(VOUT_2) D4.25(VOUT_3) D4.26(VOUT_4) D4.27(VOUT_5) D4.28(VOUT_6) D4.29(VOUT_7) D4.47(VOUT_8) D25.21(VOUT) D25.24(VOUT_2) D25.25(VOUT_3) D25.26(VOUT_4) D25.27(VOUT_5) D25.28(VOUT_6) D25.29(VOUT_7) D25.47(VOUT_8) R91.1 R319.1 ; port VCC1V0
GNDA_1V: C1.1 D4.1(AGND) D4.2(AGND_2) D4.7(STSEL) D4.34(AGND_3) D4.45(AGND_4) D25.1(AGND) D25.2(AGND_2) D25.7(STSEL) D25.34(AGND_3) D25.45(AGND_4) L13.1 L32.1 R2.1 R92.1 R320.1
VCC1V0_EN: D4.8(INH/UVLO) D4.9(INH/UVLO_2) D25.8(INH/UVLO) D25.9(INH/UVLO_2) R93.2 R321.2
VCC1V0_ISHARE: D4.16(DNC_5) D25.5(DNC_3)
VCC1V0_PG: D4.33(PWRGD) R90.2
VCC1V0_SSTR: C1.2 D4.6(SS/TR) D25.6(SS/TR)
VCC1V0_VADJ: D4.43(VADJ) D25.43(VADJ) R2.2
VCC_5V_IN: C214.1 C215.1 C237.1 C249.1 D4.39(PVIN) D4.40(PVIN_2) D4.41(PVIN_3) D4.42(VIN) D25.39(PVIN) D25.40(PVIN_2) D25.41(PVIN_3) D25.42(VIN) R90.1 R93.1 R318.1 ; port VCC_5V_IN
NetD4_10: D4.10(PH) D4.11(PH_2) D4.12(PH_3) D4.13(PH_4) D4.14(PH_5) D4.17(PH_6) D4.46(PH_7)
NetD4_35: D4.35(RT/CLK) R92.2
NetD4_44: D4.44(SENSE+) R91.2
NetD25_10: D25.10(PH) D25.11(PH_2) D25.12(PH_3) D25.13(PH_4) D25.14(PH_5) D25.17(PH_6) D25.46(PH_7)
NetD25_33: D25.33(PWRGD) R318.2
NetD25_35: D25.35(RT/CLK) R320.2
NetD25_44: D25.44(SENSE+) R319.2

Not connected (* = marked no-connect by the designer): D4 3(DNC) 4(DNC_2) 5(DNC_3) 15(DNC_4) 18(DNC_6) 19(DNC_7) 20(DNC_8) 22(DNC_9) 23(DNC_10) 30(DNC_11) 31(DNC_12) 32(DNC_13); D25 3(DNC) 4(DNC_2) 15(DNC_4) 16(DNC_5) 18(DNC_6) 19(DNC_7) 20(DNC_8) 22(DNC_9) 23(DNC_10) 30(DNC_11) 31(DNC_12) 32(DNC_13)

### Notes on the sheet
- 1V-->1.8V-->1.35V-->3.3V
- 这些管脚要?
- NOTE1:CONNECTING AN EXTERNAL CAPACITOR TO THIS PIN ADJUSTS THE OUTPUT VOLTAGE RISE TIME
- GND TO PGND STRAP AT ONLY 1 POINT
  DO NOT CONNECT AGNDS ON THIS PAGE
  TO A COMMON SYSTEM AGND
  CONNECT NEAR THE OUTPUT CAPACITORS

### Library data of the parts
C1 = C0402-0.1uF/16V: as C3 on sheet A7_JTAG&CONFIG - Ⅱ; Part_number: C0402-0.47uF/6.3V; Part_type: CAP; Value: C0402-0.47uF; temperature: -55℃\+125℃; Schematic_Part: CAP; PCB_Footprint: C0402; datasheet: #DataSheet\C_Samsung_General Capacitors.pdf#
C212-C215 C235-C237 C249 = C1210-22uF/16V: Part_type: CAP; Schematic_Part: CAP; PCB_Footprint: C1210
  C212 C213 C235 C236: Part_number: C1210-100uF/6.3V; Value: C1210-100uF/6.3V
  C214 C215 C237 C249: Part_number: C1210-47uF/10V; Value: C1210-47uF/10V
D4 D25 = LMZ31506H_RUQ_47: Part_number: LMZ31506RUQ
L13 L32 = FB0805-330R@100MHz: Manufacturer: TDK; Part_number: MPZ2012S101A; Part_type: BEAD; temperature: -55℃\+125℃; Value1: 330R@100MHz; Schematic_Part: BEAD; PCB_Footprint: R0805; Manufacturer_p/n: MPZ2012S101A
R2 = R0603-0R: Manufacturer: HKT; Manufacturer_p/n: RI0603L000JT; Part_number: R0603-2.15K/1%; Part_type: RES; Value: R0603-2.15K/1%; Schematic_Part: RES; PCB_Footprint: R0603; Manufacturer_p/n2: SAMSUNG
R90 R93 R318 R321 = R0402-10K: Manufacturer: SAMSUNG; Part_type: RES; Value: R0402-10K; Schematic_Part: RES; PCB_Footprint: R0402
  R90 R318: Part_number: R0402-10K
  R93: Part_number: R0402-68K
  R321: Part_number: R0402-27K
R91 R319 = R0402-49.9R/1%: Manufacturer: SUPEROHM; Manufacturer_p/n: RR10050402L49R9FT; Part_number: R0402-49.9R/1%; Part_type: RES; Value: R0402-49.9R/1%; Schematic_Part: RES; PCB_Footprint: R0402
R92 R320 = R0805-267K/1%: Manufacturer: SAMSUNG; Part_number: R0805-267K/1%; Part_type: RES; Value: R0805-267K/1%; Schematic_Part: RES; PCB_Footprint: R0805